# Altium project 采集卡第一版.PrjPCB (part 1 of 2)
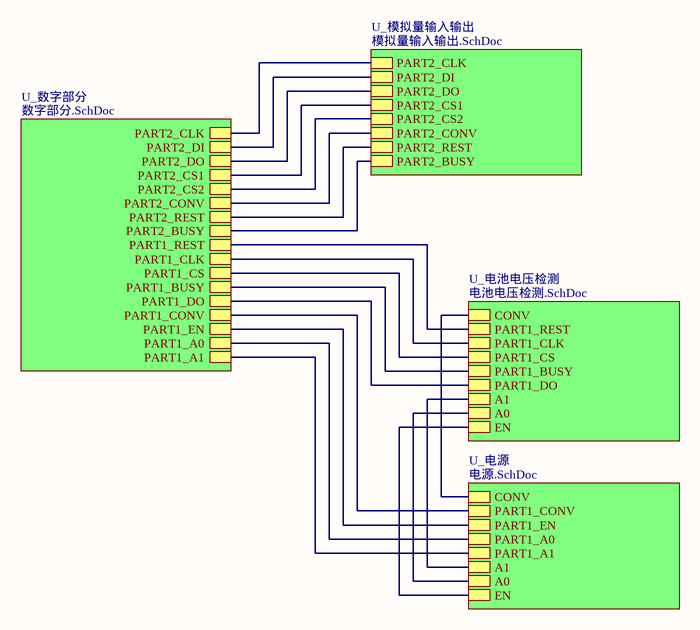
[diagram p0: 采集卡.SchDoc]
6 sheets, 612 parts. Net scope: hierarchical (ports join the sheet entries above them; power ports are global).
Board file: 采集卡.PcbDoc
Sheets:
  采集卡.SchDoc
    U_模拟量输入输出 = 模拟量输入输出.SchDoc
    U_电池电压检测 = 电池电压检测.SchDoc
      DI1 = AD628模块.SchDoc
      DI2 = AD628模块.SchDoc
      DI3 = AD628模块.SchDoc
      DI4 = AD628模块.SchDoc
      DI5 = AD628模块.SchDoc
      DI6 = AD628模块.SchDoc
      DI7 = AD628模块.SchDoc
      DI8 = AD628模块.SchDoc
    U_电源 = 电源.SchDoc
    U_数字部分 = 数字部分.SchDoc

## Sheet 采集卡.SchDoc
size A4

### Sub-sheets
U_数字部分 = 数字部分.SchDoc: PART1_REST, PART1_CLK, PART1_CS, PART1_BUSY, PART1_DO, PART1_CONV, PART1_EN, PART1_A0, PART1_A1, PART2_CLK, PART2_DI, PART2_DO, PART2_CS1, PART2_CS2, PART2_CONV, PART2_REST, PART2_BUSY
U_模拟量输入输出 = 模拟量输入输出.SchDoc: PART2_CLK, PART2_DI, PART2_DO, PART2_CS1, PART2_CS2, PART2_CONV, PART2_REST, PART2_BUSY
U_电池电压检测 = 电池电压检测.SchDoc: CONV, PART1_REST, PART1_CLK, PART1_CS, PART1_BUSY, PART1_DO, A1, A0, EN
U_电源 = 电源.SchDoc: CONV, PART1_CONV, PART1_EN, PART1_A0, PART1_A1, A1, A0, EN

### Nets
A0: sheet U_电池电压检测/A0, sheet U_电源/A0
A1: sheet U_电池电压检测/A1, sheet U_电源/A1
CONVA: sheet U_电池电压检测/CONV, sheet U_电源/CONV
DOUT1: sheet U_电池电压检测/PART1_REST, sheet U_数字部分/PART1_REST
DOUT2: sheet U_电源/PART1_EN, sheet U_数字部分/PART1_EN
DOUT3: sheet U_电源/PART1_A0, sheet U_数字部分/PART1_A0
DOUT4: sheet U_电源/PART1_A1, sheet U_数字部分/PART1_A1
DOUT5: sheet U_模拟量输入输出/PART2_REST, sheet U_数字部分/PART2_REST
EN: sheet U_电池电压检测/EN, sheet U_电源/EN
INT1: sheet U_电池电压检测/PART1_BUSY, sheet U_数字部分/PART1_BUSY
INT2: sheet U_模拟量输入输出/PART2_BUSY, sheet U_数字部分/PART2_BUSY
PWM1: sheet U_电源/PART1_CONV, sheet U_数字部分/PART1_CONV
PWM2: sheet U_模拟量输入输出/PART2_CONV, sheet U_数字部分/PART2_CONV
SPI1CS: sheet U_电池电压检测/PART1_CS, sheet U_数字部分/PART1_CS
SPI1DO: sheet U_电池电压检测/PART1_DO, sheet U_数字部分/PART1_DO
SPI1SCK: sheet U_电池电压检测/PART1_CLK, sheet U_数字部分/PART1_CLK
SPI2CS1: sheet U_模拟量输入输出/PART2_CS1, sheet U_数字部分/PART2_CS1
SPI2CS2: sheet U_模拟量输入输出/PART2_CS2, sheet U_数字部分/PART2_CS2
SPI2DI: sheet U_模拟量输入输出/PART2_DI, sheet U_数字部分/PART2_DI
SPI2DO: sheet U_模拟量输入输出/PART2_DO, sheet U_数字部分/PART2_DO
SPI2SCK: sheet U_模拟量输入输出/PART2_CLK, sheet U_数字部分/PART2_CLK

## Sheet 模拟量输入输出.SchDoc
size A1
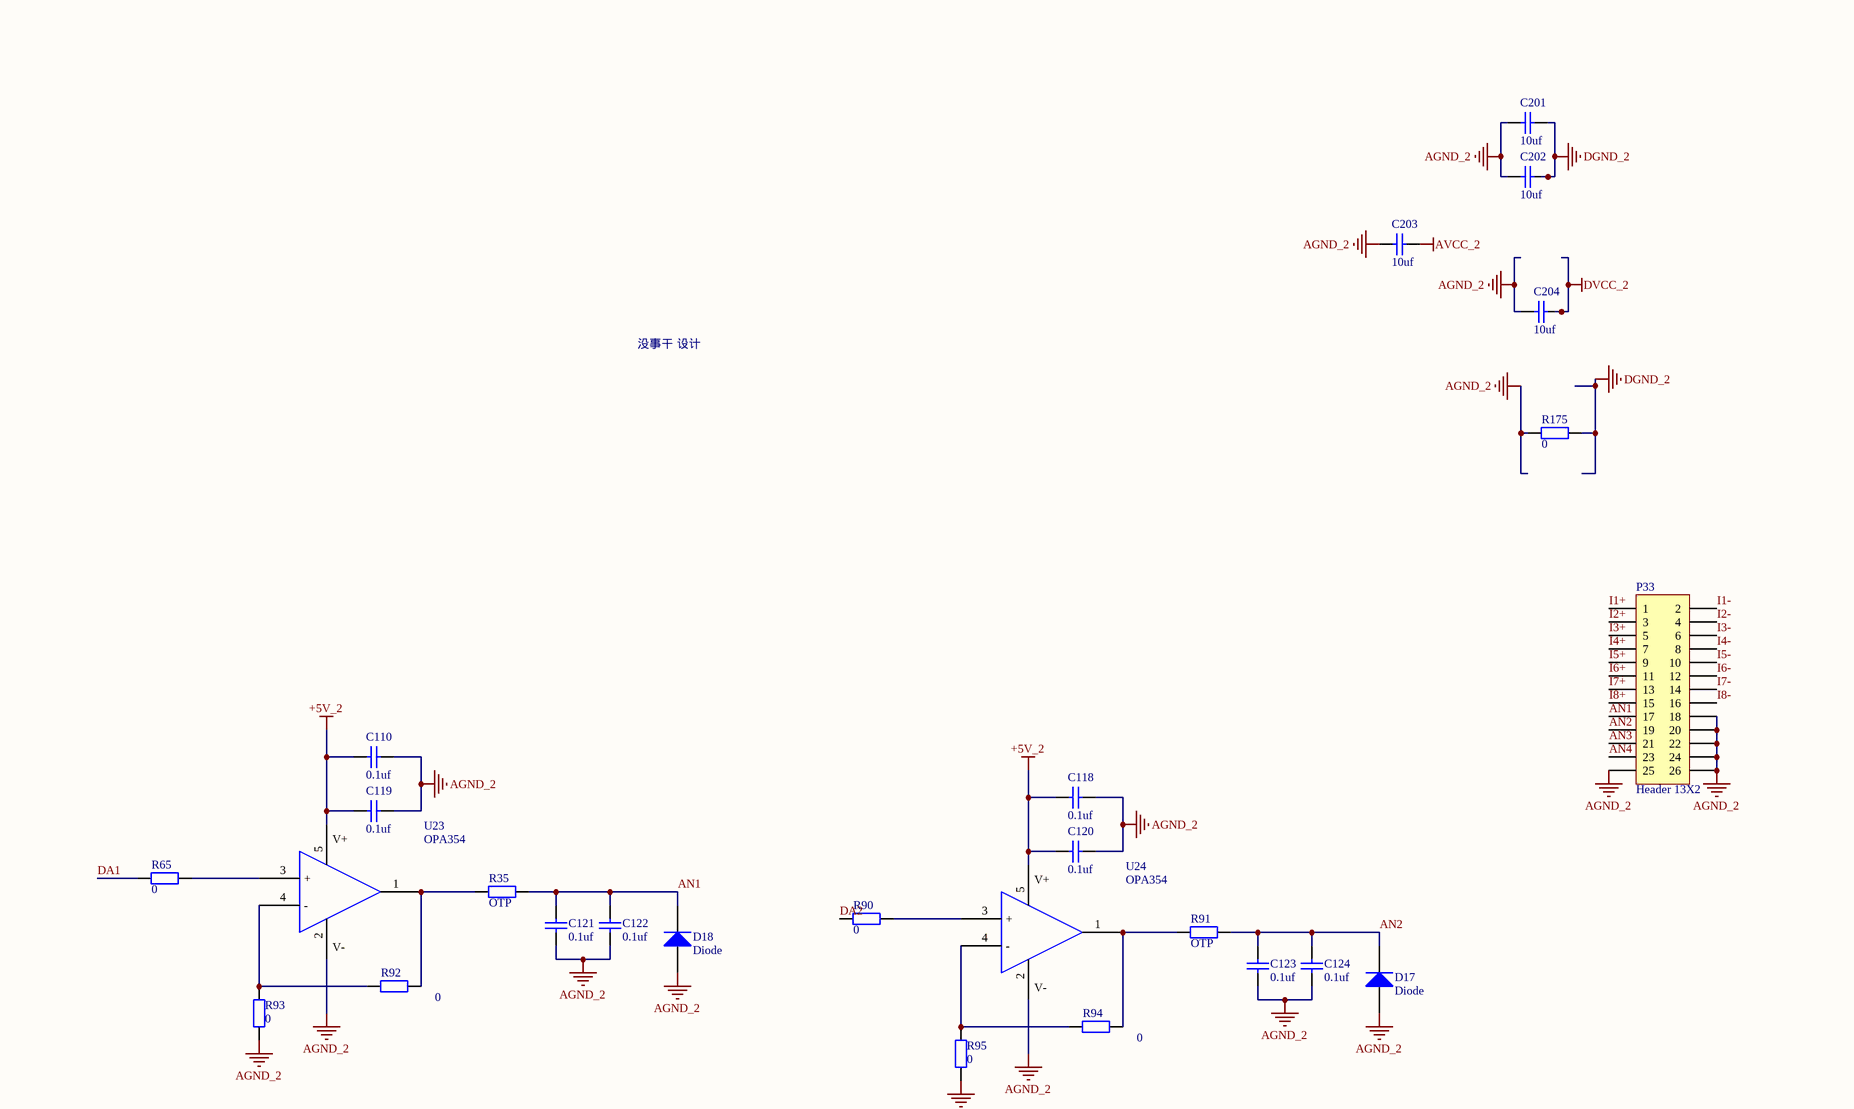
[diagram p1: 模拟量输入输出.SchDoc, top left]
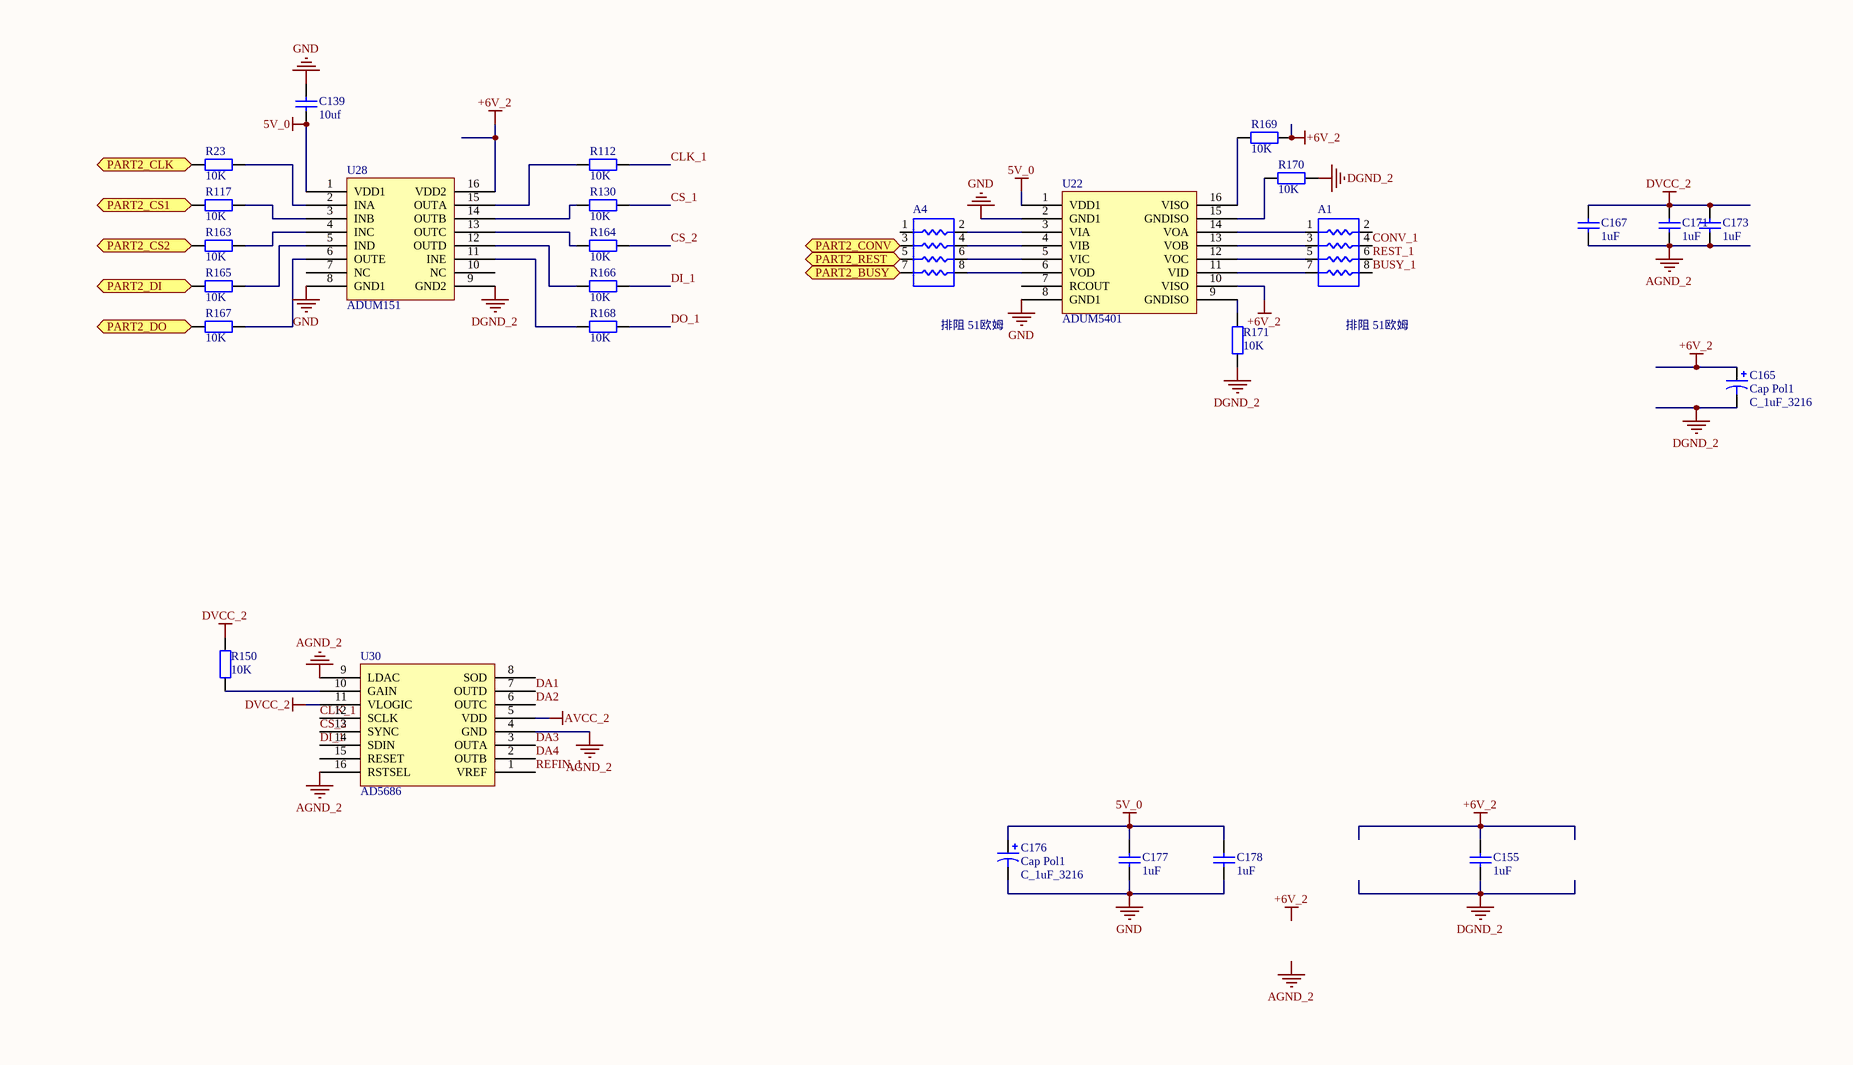
[diagram p2: 模拟量输入输出.SchDoc, top right]
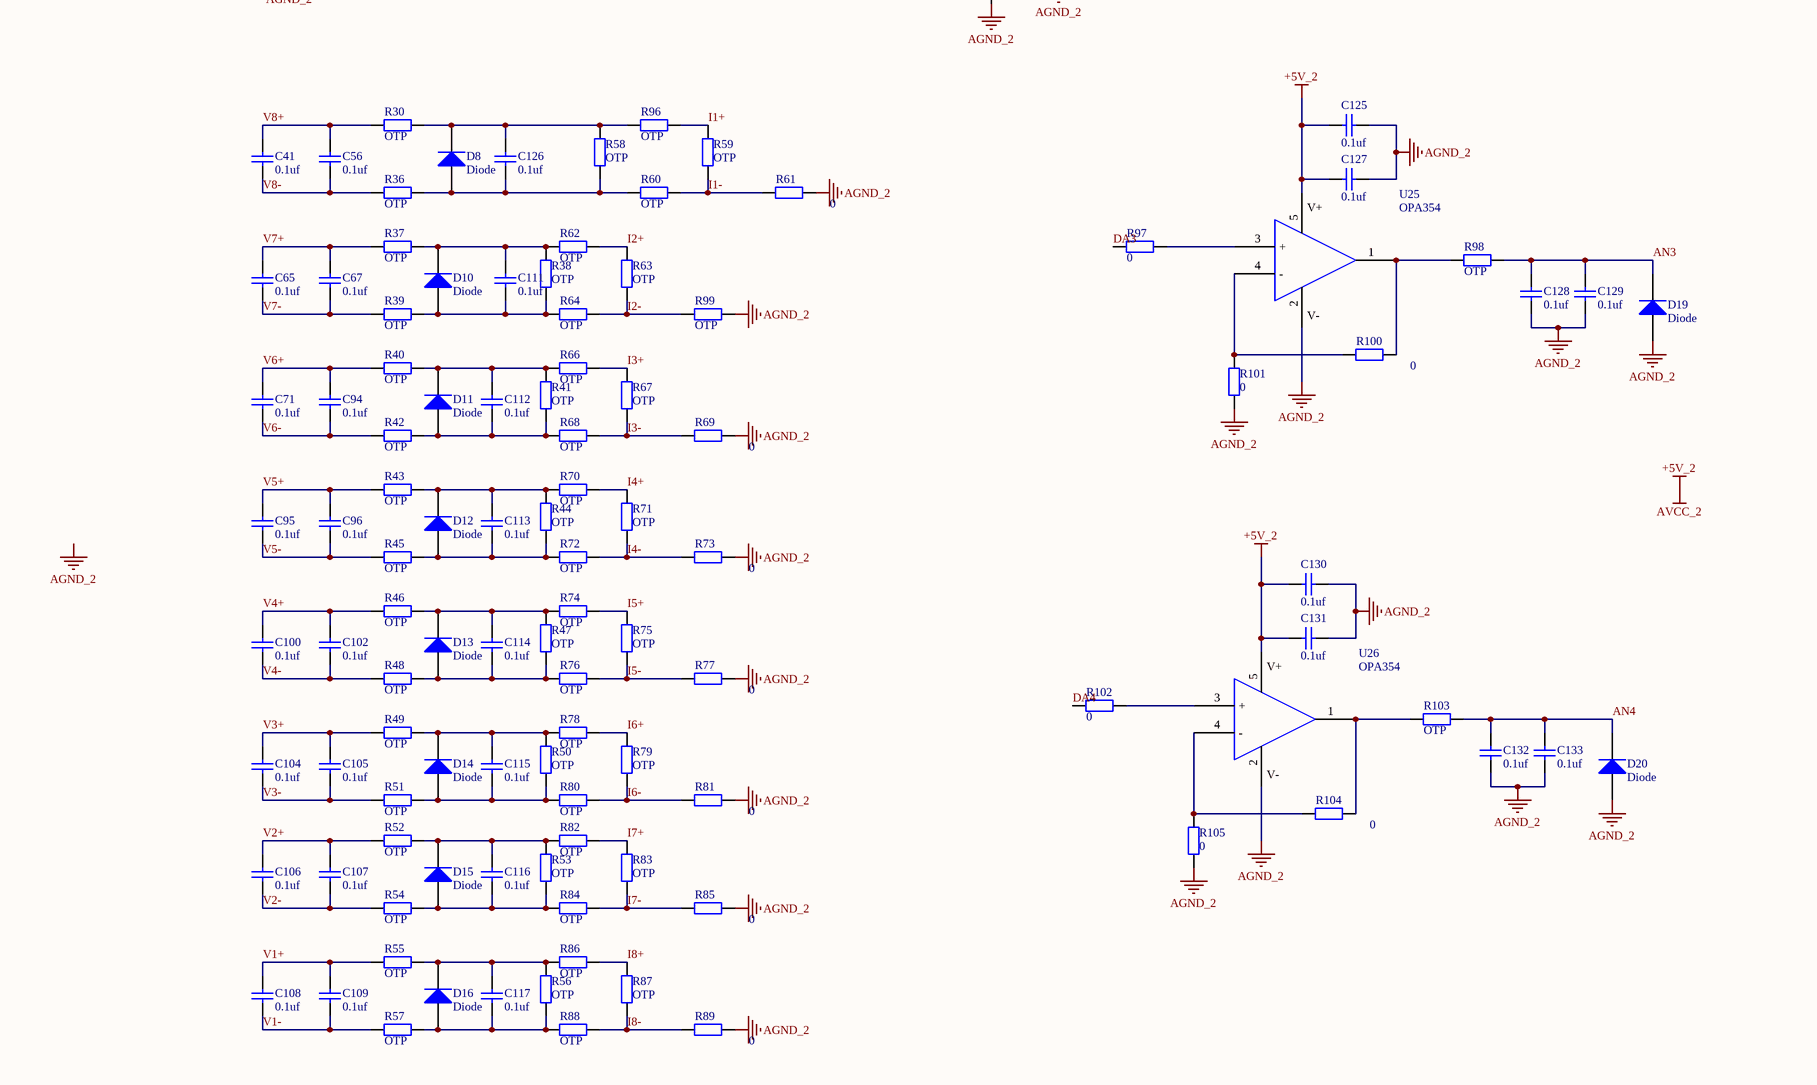
[diagram p3: 模拟量输入输出.SchDoc, bottom left]
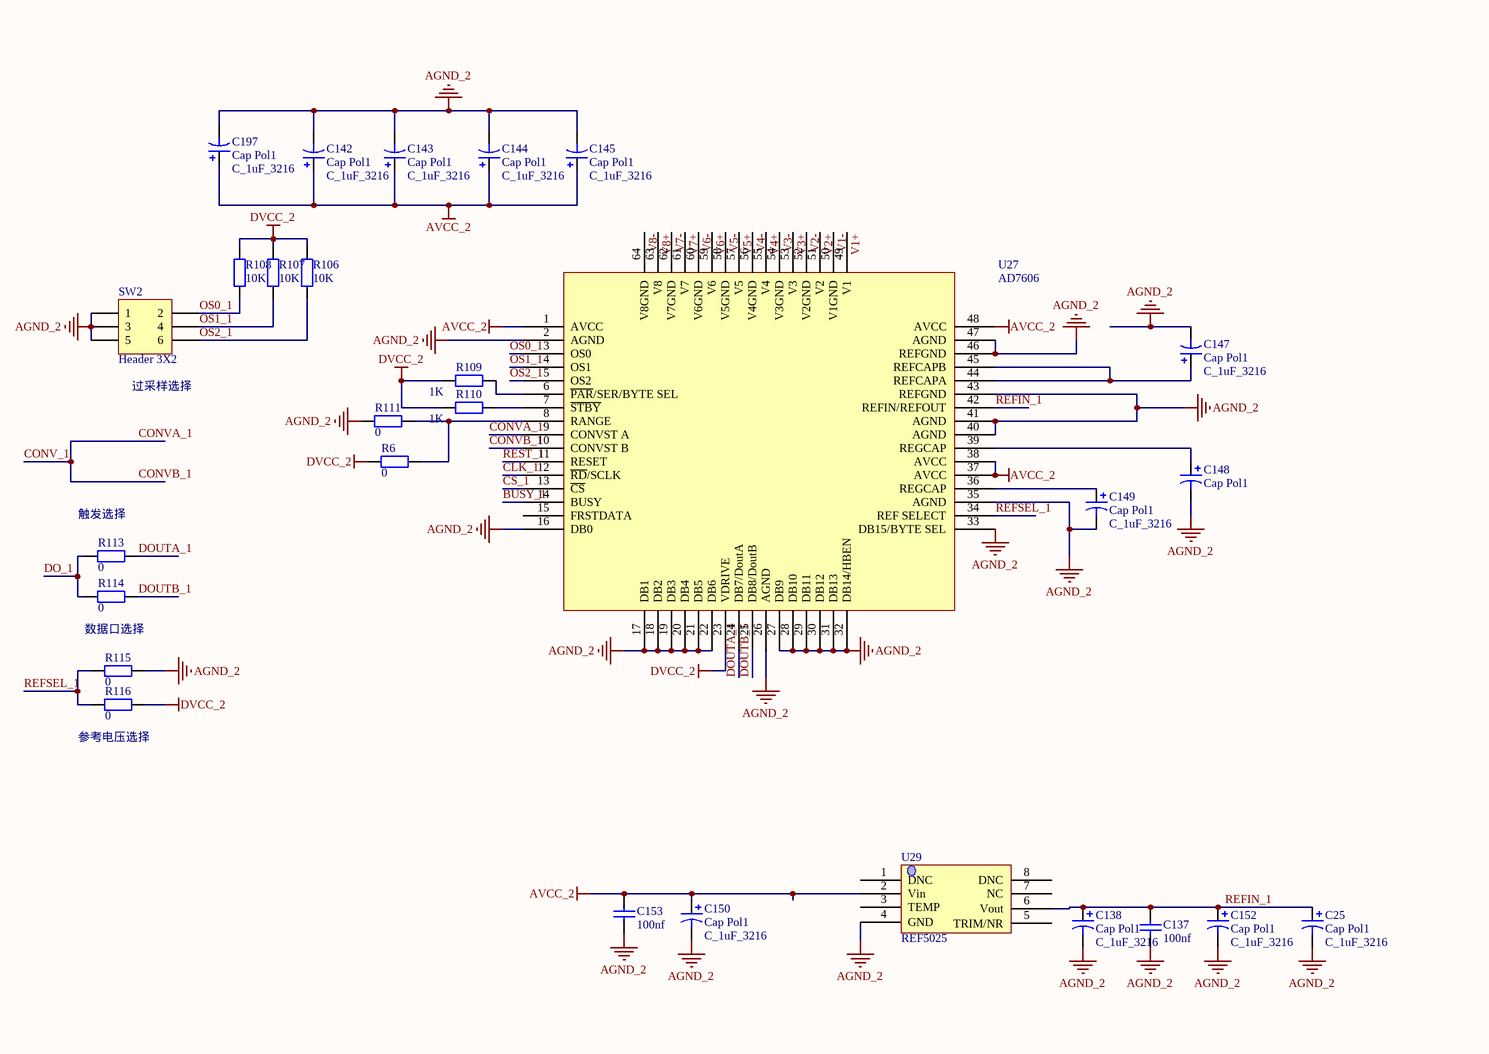
[diagram p4: 模拟量输入输出.SchDoc, bottom right]

### Parts
A1  排阻 51欧姆  [RCA03-4D]
A4  排阻 51欧姆  [RCA03-4D]
C25  Cap Pol1  value C_1uF_3216  [3216]
C41  value 0.1uf  [0805C]  (hidden comment: Cap)
C56  value 0.1uf  [0805C]  (hidden comment: Cap)
C65  value 0.1uf  [0805C]  (hidden comment: Cap)
C67  value 0.1uf  [0805C]  (hidden comment: Cap)
C71  value 0.1uf  [0805C]  (hidden comment: Cap)
C94  value 0.1uf  [0805C]  (hidden comment: Cap)
C95  value 0.1uf  [0805C]  (hidden comment: Cap)
C96  value 0.1uf  [0805C]  (hidden comment: Cap)
C100  value 0.1uf  [0805C]  (hidden comment: Cap)
C102  value 0.1uf  [0805C]  (hidden comment: Cap)
C104  value 0.1uf  [0805C]  (hidden comment: Cap)
C105  value 0.1uf  [0805C]  (hidden comment: Cap)
C106  value 0.1uf  [0805C]  (hidden comment: Cap)
C107  value 0.1uf  [0805C]  (hidden comment: Cap)
C108  value 0.1uf  [0805C]  (hidden comment: Cap)
C109  value 0.1uf  [0805C]  (hidden comment: Cap)
C110  value 0.1uf  [0805C]  (hidden comment: Cap)
C111  value 0.1uf  [0805C]  (hidden comment: Cap)
C112  value 0.1uf  [0805C]  (hidden comment: Cap)
C113  value 0.1uf  [0805C]  (hidden comment: Cap)
C114  value 0.1uf  [0805C]  (hidden comment: Cap)
C115  value 0.1uf  [0805C]  (hidden comment: Cap)
C116  value 0.1uf  [0805C]  (hidden comment: Cap)
C117  value 0.1uf  [0805C]  (hidden comment: Cap)
C118  value 0.1uf  [0805C]  (hidden comment: Cap)
C119  value 0.1uf  [0805C]  (hidden comment: Cap)
C120  value 0.1uf  [0805C]  (hidden comment: Cap)
C121  value 0.1uf  [0805C]  (hidden comment: Cap)
C122  value 0.1uf  [0805C]  (hidden comment: Cap)
C123  value 0.1uf  [0805C]  (hidden comment: Cap)
C124  value 0.1uf  [0805C]  (hidden comment: Cap)
C125  value 0.1uf  [0805C]  (hidden comment: Cap)
C126  value 0.1uf  [0805C]  (hidden comment: Cap)
C127  value 0.1uf  [0805C]  (hidden comment: Cap)
C128  value 0.1uf  [0805C]  (hidden comment: Cap)
C129  value 0.1uf  [0805C]  (hidden comment: Cap)
C130  value 0.1uf  [0805C]  (hidden comment: Cap)
C131  value 0.1uf  [0805C]  (hidden comment: Cap)
C132  value 0.1uf  [0805C]  (hidden comment: Cap)
C133  value 0.1uf  [0805C]  (hidden comment: Cap)
C137  value 100nf  [0805C]  (hidden comment: Cap)
C138  Cap Pol1  value C_1uF_3216  [3216]
C139  value 10uf  [0805C]  (hidden comment: Cap)
C142  Cap Pol1  value C_1uF_3216  [3216]
C143  Cap Pol1  value C_1uF_3216  [3216]
C144  Cap Pol1  value C_1uF_3216  [3216]
C145  Cap Pol1  value C_1uF_3216  [3216]
C147  Cap Pol1  value C_1uF_3216  [3216]
C148  Cap Pol1  [3216]
C149  Cap Pol1  value C_1uF_3216  [3216]
C150  Cap Pol1  value C_1uF_3216  [3216]
C152  Cap Pol1  value C_1uF_3216  [3216]
C153  value 100nf  [0805C]  (hidden comment: Cap)
C155  1uF  [0805C]
C165  Cap Pol1  value C_1uF_3216  [3216]
C167  1uF  [0805C]
C171  1uF  [0805C]
C173  1uF  [0805C]
C176  Cap Pol1  value C_1uF_3216  [3216]
C177  1uF  [0805C]
C178  1uF  [0805C]
C197  Cap Pol1  value C_1uF_3216  [3216]
C201  value 10uf  [0805C]  (hidden comment: Cap)
C202  value 10uf  [0805C]  (hidden comment: Cap)
C203  value 10uf  [0805C]  (hidden comment: Cap)
C204  value 10uf  [0805C]  (hidden comment: Cap)
D8  Diode  [SMA]
D10  Diode  [SMA]
D11  Diode  [SMA]
D12  Diode  [SMA]
D13  Diode  [SMA]
D14  Diode  [SMA]
D15  Diode  [SMA]
D16  Diode  [SMA]
D17  Diode  [SMA]
D18  Diode  [SMA]
D19  Diode  [SMA]
D20  Diode  [SMA]
P33  Header 13X2  [3.5MM-2*12P]
R6  value 0  [0805R]  (hidden comment: Res2)
R23  value 10K  [0805R]  (hidden comment: Res2)
R30  value OTP  [0805R]  (hidden comment: Res2)
R35  value OTP  [0805R]  (hidden comment: Res2)
R36  value OTP  [0805R]  (hidden comment: Res2)
R37  value OTP  [0805R]  (hidden comment: Res2)
R38  value OTP  [0805R]  (hidden comment: Res2)
R39  value OTP  [0805R]  (hidden comment: Res2)
R40  value OTP  [0805R]  (hidden comment: Res2)
R41  value OTP  [0805R]  (hidden comment: Res2)
R42  value OTP  [0805R]  (hidden comment: Res2)
R43  value OTP  [0805R]  (hidden comment: Res2)
R44  value OTP  [0805R]  (hidden comment: Res2)
R45  value OTP  [0805R]  (hidden comment: Res2)
R46  value OTP  [0805R]  (hidden comment: Res2)
R47  value OTP  [0805R]  (hidden comment: Res2)
R48  value OTP  [0805R]  (hidden comment: Res2)
R49  value OTP  [0805R]  (hidden comment: Res2)
R50  value OTP  [0805R]  (hidden comment: Res2)
R51  value OTP  [0805R]  (hidden comment: Res2)
R52  value OTP  [0805R]  (hidden comment: Res2)
R53  value OTP  [0805R]  (hidden comment: Res2)
R54  value OTP  [0805R]  (hidden comment: Res2)
R55  value OTP  [0805R]  (hidden comment: Res2)
R56  value OTP  [0805R]  (hidden comment: Res2)
R57  value OTP  [0805R]  (hidden comment: Res2)
R58  value OTP  [0805R]  (hidden comment: Res2)
R59  value OTP  [FB1206]  (hidden comment: Res2)
R60  value OTP  [0805R]  (hidden comment: Res2)
R61  value 0  [0603AR]  (hidden comment: Res2)
R62  value OTP  [0805R]  (hidden comment: Res2)
R63  value OTP  [FB1206]  (hidden comment: Res2)
R64  value OTP  [0805R]  (hidden comment: Res2)
R65  value 0  [0805R]  (hidden comment: Res2)
R66  value OTP  [0805R]  (hidden comment: Res2)
R67  value OTP  [FB1206]  (hidden comment: Res2)
R68  value OTP  [0805R]  (hidden comment: Res2)
R69  value 0  [0603AR]  (hidden comment: Res2)
R70  value OTP  [0805R]  (hidden comment: Res2)
R71  value OTP  [FB1206]  (hidden comment: Res2)
R72  value OTP  [0805R]  (hidden comment: Res2)
R73  value 0  [0603AR]  (hidden comment: Res2)
R74  value OTP  [0805R]  (hidden comment: Res2)
R75  value OTP  [FB1206]  (hidden comment: Res2)
R76  value OTP  [0805R]  (hidden comment: Res2)
R77  value 0  [0603AR]  (hidden comment: Res2)
R78  value OTP  [0805R]  (hidden comment: Res2)
R79  value OTP  [FB1206]  (hidden comment: Res2)
R80  value OTP  [0805R]  (hidden comment: Res2)
R81  value 0  [0603AR]  (hidden comment: Res2)
R82  value OTP  [0805R]  (hidden comment: Res2)
R83  value OTP  [FB1206]  (hidden comment: Res2)
R84  value OTP  [0805R]  (hidden comment: Res2)
R85  value 0  [0603AR]  (hidden comment: Res2)
R86  value OTP  [0805R]  (hidden comment: Res2)
R87  value OTP  [FB1206]  (hidden comment: Res2)
R88  value OTP  [0805R]  (hidden comment: Res2)
R89  value 0  [0603AR]  (hidden comment: Res2)
R90  value 0  [0805R]  (hidden comment: Res2)
R91  value OTP  [0805R]  (hidden comment: Res2)
R92  value 0  [0805R]  (hidden comment: Res2)
R93  value 0  [0805R]  (hidden comment: Res2)
R94  value 0  [0805R]  (hidden comment: Res2)
R95  value 0  [0805R]  (hidden comment: Res2)
R96  value OTP  [0805R]  (hidden comment: Res2)
R97  value 0  [0805R]  (hidden comment: Res2)
R98  value OTP  [0805R]  (hidden comment: Res2)
R99  value OTP  [0603AR]  (hidden comment: Res2)
R100  value 0  [0805R]  (hidden comment: Res2)
R101  value 0  [0805R]  (hidden comment: Res2)
R102  value 0  [0805R]  (hidden comment: Res2)
R103  value OTP  [0805R]  (hidden comment: Res2)
R104  value 0  [0805R]  (hidden comment: Res2)
R105  value 0  [0805R]  (hidden comment: Res2)
R106  value 10K  [0805R]  (hidden comment: Res2)
R107  value 10K  [0805R]  (hidden comment: Res2)
R108  value 10K  [0805R]  (hidden comment: Res2)
R109  value 1K  [0805R]  (hidden comment: Res2)
R110  value 1K  [0805R]  (hidden comment: Res2)
R111  value 0  [0805R]  (hidden comment: Res2)
R112  value 10K  [0805R]  (hidden comment: Res2)
R113  value 0  [0805R]  (hidden comment: Res2)
R114  value 0  [0805R]  (hidden comment: Res2)
R115  value 0  [0805R]  (hidden comment: Res2)
R116  value 0  [0805R]  (hidden comment: Res2)
R117  value 10K  [0805R]  (hidden comment: Res2)
R130  value 10K  [0805R]  (hidden comment: Res2)
R150  value 10K  [0805R]  (hidden comment: Res2)
R163  value 10K  [0805R]  (hidden comment: Res2)
R164  value 10K  [0805R]  (hidden comment: Res2)
R165  value 10K  [0805R]  (hidden comment: Res2)
R166  value 10K  [0805R]  (hidden comment: Res2)
R167  value 10K  [0805R]  (hidden comment: Res2)
R168  value 10K  [0805R]  (hidden comment: Res2)
R169  value 10K  [0603AR]  (hidden comment: Res2)
R170  value 10K  [0603AR]  (hidden comment: Res2)
R171  value 10K  [0603AR]  (hidden comment: Res2)
R175  value 0  [0805R]  (hidden comment: Res2)
SW2  Header 3X2  [SW_6]
U22  ADUM5401  [SOL-16_L]
U23  OPA354  [SOT23-5]
U24  OPA354  [SOT23-5]
U25  OPA354  [SOT23-5]
U26  OPA354  [SOT23-5]
U27  AD7606  [TQFP64]
U28  ADUM151  [SO16NB]
U29  REF5025  [MSOP8]
U30  AD5686  [TSSOP16]

### Ports
PART2_BUSY, PART2_CLK, PART2_CONV, PART2_CS1, PART2_CS2, PART2_DI, PART2_DO, PART2_REST

### Nets
5V_0: C139.2 C176.1 C177.1 C178.1 U22.1(VDD1) U28.1(VDD1)
+5V_2: C110.2 C118.2 C119.2 C120.2 C125.2 C127.2 C130.2 C131.2 C142.1 C143.1 C144.1 C145.1 C150.1 C153.2 C197.1 C203.1 U23.5(V+) U24.5(V+) U25.5(V+) U26.5(V+) U27.1(AVCC) U27.37(AVCC) U27.38(AVCC) U27.48(AVCC) U29.2(Vin) U30.5(VDD)  [also labelled AVCC_2]
+6V_2: C155.1 C165.1 R169.1 U22.10(VISO) U28.16(VDD2)
AGND_2: C25.2 C110.1 C118.1 C119.1 C120.1 C121.1 C122.1 C123.1 C124.1 C125.1 C127.1 C128.1 C129.1 C130.1 C131.1 C132.1 C133.1 C137.1 C138.2 C142.2 C143.2 C144.2 C145.2 C147.2 C148.2 C149.2 C150.2 C152.2 C153.1 C167.2 C171.2 C173.2 C197.2 C201.2 C202.2 C203.2 C204.2 D17.1(A) D18.1(A) D19.1(A) D20.1(A) P33.18 P33.20 P33.22 P33.24 P33.25 P33.26 R61.1 R69.1 R73.1 R77.1 R81.1 R85.1 R89.1 R93.2 R95.2 R99.1 R101.2 R105.2 R111.2 R115.1 R175.2 SW2.1 SW2.3 SW2.5 U23.2(V-) U24.2(V-) U25.2(V-) U26.2(V-) U27.2(AGND) U27.16(DB0) U27.17(DB1) U27.18(DB2) U27.19(DB3) U27.20(DB4) U27.21(DB5) U27.22(DB6) U27.26(AGND) U27.27(DB9) U27.28(DB10) U27.29(DB11) U27.30(DB12) U27.31(DB13) U27.32(DB14/HBEN) U27.33(DB15/BYTE_SEL) U27.35(AGND) U27.40(AGND) U27.41(AGND) U27.43(REFGND) U27.46(REFGND) U27.47(AGND) U29.4(GND) U30.4(GND) U30.9(LDAC) U30.16(RSTSEL)
DGND_2: C155.2 C165.2 C201.1 C202.1 R170.1 R171.2 R175.1 U28.9(GND2)
DVCC_2: C167.1 C171.1 C173.1 C204.1 R6.2 R106.1 R107.1 R108.1 R109.2 R110.2 R116.1 R150.1 U27.23(VDRIVE) U30.11(VLOGIC)
GND: C139.1 C176.2 C177.2 C178.2 U22.2(GND1) U22.8(GND1) U28.8(GND1)
AN1: C121.2 C122.2 D18.2(K) P33.17 R35.2
AN2: C123.2 C124.2 D17.2(K) P33.19 R91.2
AN3: C128.2 C129.2 D19.2(K) P33.21 R98.2
AN4: C132.2 C133.2 D20.2(K) P33.23 R103.2
BUSY_1: A1.8 U27.14(BUSY)
CLK_1: R112.1 U27.12(~{RD}/SCLK) U30.12(SCLK)
CONV_1: A1.4 U27.9(CONVST_A) U27.10(CONVST_B)  [also labelled CONVA_1, CONVB_1]
CS_1: R130.1 U27.13(~{CS})
CS_2: R164.1 U30.13(SYNC)
DA1: R65.1 U30.7(OUTD)
DA2: R90.1 U30.6(OUTC)
DA3: R97.1 U30.3(OUTA)
DA4: R102.1 U30.2(OUTB)
DI_1: R166.1 U30.14(SDIN)
DO_1: R113.1 R114.1 R168.1
DOUT5: A4.5 ; port PART2_REST
DOUTA_1: R113.2 U27.24(DB7/DoutA)
DOUTB_1: R114.2 U27.25(DB8/DoutB)
I1+: P33.1 R59.2 R96.2
I1-: P33.2 R59.1 R60.2 R61.2
I2+: P33.3 R62.2 R63.1
I2-: P33.4 R63.2 R64.2 R99.2
I3+: P33.5 R66.2 R67.1
I3-: P33.6 R67.2 R68.2 R69.2
I4+: P33.7 R70.2 R71.1
I4-: P33.8 R71.2 R72.2 R73.2
I5+: P33.9 R74.2 R75.1
I5-: P33.10 R75.2 R76.2 R77.2
I6+: P33.11 R78.2 R79.1
I6-: P33.12 R79.2 R80.2 R81.2
I7+: P33.13 R82.2 R83.1
I7-: P33.14 R83.2 R84.2 R85.2
I8+: P33.15 R86.2 R87.1
I8-: P33.16 R87.2 R88.2 R89.2
INT2: A4.7 ; port PART2_BUSY
OS0_1: R108.2 SW2.2 U27.3(OS0)
OS1_1: R107.2 SW2.4 U27.4(OS1)
OS2_1: R106.2 SW2.6 U27.5(OS2)
PWM2: A4.3 ; port PART2_CONV
REFIN_1: C25.1 C137.2 C138.1 C152.1 U27.42(REFIN/REFOUT) U29.6(Vout) U30.1(VREF)
REFSEL_1: R115.2 R116.2 U27.34(REF_SELECT)
REST_1: A1.6 U27.11(RESET)
SPI2CS1: R117.2 ; port PART2_CS1
SPI2CS2: R163.2 ; port PART2_CS2
SPI2DI: R165.2 ; port PART2_DI
SPI2DO: R167.2 ; port PART2_DO
SPI2SCK: R23.2 ; port PART2_CLK
V1+: C108.2 C109.2 R55.2 U27.49(V1)
V1-: C108.1 C109.1 R57.2 U27.50(V1GND)
V2+: C106.2 C107.2 R52.2 U27.51(V2)
V2-: C106.1 C107.1 R54.2 U27.52(V2GND)
V3+: C104.2 C105.2 R49.2 U27.53(V3)
V3-: C104.1 C105.1 R51.2 U27.54(V3GND)
V4+: C100.2 C102.2 R46.2 U27.55(V4)
V4-: C100.1 C102.1 R48.2 U27.56(V4GND)
V5+: C95.2 C96.2 R43.2 U27.57(V5)
V5-: C95.1 C96.1 R45.2 U27.58(V5GND)
V6+: C71.2 C94.2 R40.2 U27.59(V6)
V6-: C71.1 C94.1 R42.2 U27.60(V6GND)
V7+: C65.2 C67.2 R37.2 U27.61(V7)
V7-: C65.1 C67.1 R39.2 U27.62(V7GND)
V8+: C41.2 C56.2 R30.2 U27.63(V8)
V8-: C41.1 C56.1 R36.2 U27.64(V8GND)
NetA1_1: A1.1 U22.14(VOA)
NetA1_3: A1.3 U22.13(VOB)
NetA1_5: A1.5 U22.12(VOC)
NetA1_7: A1.7 U22.11(VID)
NetA4_2: A4.2 U22.3(VIA)
NetA4_4: A4.4 U22.4(VIB)
NetA4_6: A4.6 U22.5(VIC)
NetA4_8: A4.8 U22.6(VOD)
NetC111_1: C111.1 D10.1(A) R38.2 R39.1 R64.1
NetC111_2: C111.2 D10.2(K) R37.1 R38.1 R62.1
NetC112_1: C112.1 D11.1(A) R41.2 R42.1 R68.1
NetC112_2: C112.2 D11.2(K) R40.1 R41.1 R66.1
NetC113_1: C113.1 D12.1(A) R44.2 R45.1 R72.1
NetC113_2: C113.2 D12.2(K) R43.1 R44.1 R70.1
NetC114_1: C114.1 D13.1(A) R47.2 R48.1 R76.1
NetC114_2: C114.2 D13.2(K) R46.1 R47.1 R74.1
NetC115_1: C115.1 D14.1(A) R50.2 R51.1 R80.1
NetC115_2: C115.2 D14.2(K) R49.1 R50.1 R78.1
NetC116_1: C116.1 D15.1(A) R53.2 R54.1 R84.1
NetC116_2: C116.2 D15.2(K) R52.1 R53.1 R82.1
NetC117_1: C117.1 D16.1(A) R56.2 R57.1 R88.1
NetC117_2: C117.2 D16.2(K) R55.1 R56.1 R86.1
NetC126_1: C126.1 D8.1(A) R36.1 R58.1 R60.1
NetC126_2: C126.2 D8.2(K) R30.1 R58.2 R96.1
NetC147_1: C147.1 U27.44(REFCAPA) U27.45(REFCAPB)
NetC148_1: C148.1 U27.39(REGCAP)
NetC149_1: C149.1 U27.36(REGCAP)
NetR6_1: R6.1 R111.1 U27.8(RANGE)
NetR23_1: R23.1 U28.2(INA)
NetR35_1: R35.1 R92.1 U23.1(OUT)
NetR65_2: R65.2 U23.3(+)
NetR90_2: R90.2 U24.3(+)
NetR91_1: R91.1 R94.1 U24.1(OUT)
NetR92_2: R92.2 R93.1 U23.4(-)
NetR94_2: R94.2 R95.1 U24.4(-)
NetR97_2: R97.2 U25.3(+)
NetR98_1: R98.1 R100.1 U25.1(OUT)
NetR100_2: R100.2 R101.1 U25.4(-)
NetR102_2: R102.2 U26.3(+)
NetR103_1: R103.1 R104.1 U26.1(OUT)
NetR104_2: R104.2 R105.1 U26.4(-)
NetR109_1: R109.1 U27.6(~{PAR}/SER/BYTE_SEL)
NetR110_1: R110.1 U27.7(~{STBY})
NetR112_2: R112.2 U28.15(OUTA)
NetR117_1: R117.1 U28.3(INB)
NetR130_2: R130.2 U28.14(OUTB)
NetR150_2: R150.2 U30.10(GAIN)
NetR163_1: R163.1 U28.4(INC)
NetR164_2: R164.2 U28.13(OUTC)
NetR165_1: R165.1 U28.5(IND)
NetR166_2: R166.2 U28.12(OUTD)
NetR167_1: R167.1 U28.6(OUTE)
NetR168_2: R168.2 U28.11(INE)
NetR169_2: R169.2 U22.16(VISO)
NetR170_2: R170.2 U22.15(GNDISO)
NetR171_1: R171.1 U22.9(GNDISO)

Not connected (* = marked no-connect by the designer): A1 2; A4 1; U22 7(RCOUT); U27 15(FRSTDATA); U28 7(NC) 10(NC); U29 1(DNC) 3(TEMP) 5(TRIM/NR) 7(NC) 8(DNC); U30 8(SOD) 15(RESET)

### Notes on the sheet
- 没事干 设计
- (near SW2) 过采样选择
- (near R113) 触发选择
- 数据口选择
- (near R116) 参考电压选择
- Labels drawn without touching a wire or pin: +6V_2, AGND_2

### Library data of the parts
A1 A4 = RESPACK5
C25 C138 C142-C145 C147-C150 C152 C165 C176 C197 = Cap Pol1: Polarized Capacitor (Radial); Published: 8-Jun-2000; LatestRevisionDate: 17-Jul-2002; LatestRevisionNote: Re-released for DXP Platform.; PackageReference: RB7.6-15; Publisher: Altium Limited
C41 C56 C65 C67 C71 C94-C96 C100 C102 C104-C133 C137 C139 C153 C155 C167 C171 C173 C177 C178 C201-C204 = Cap: Capacitor; Published: 8-Jun-2000; LatestRevisionDate: 17-Jul-2002; LatestRevisionNote: Re-released for DXP Platform.; PackageReference: RAD-0.3; Publisher: Altium Limited; PackageDescription: Radial Cap, Thru-Hole; 2 Leads; 0.3 in Pin Spacing
  C155 C167 C171 C173 C177 C178: Value: 1uF
D8 D10-D20 = Diode: Default Diode; Published: 8-Jun-2000; LatestRevisionDate: 17-Jul-2002; LatestRevisionNote: Re-released for DXP Platform.; PackageVersion: Sep-1996; PackageReference: SMC; Publisher: Altium Limited; PackageDescription: DO-214-AB/SMC; 2 C-Bend Leads; Body 7.9 x 5.9 mm, inc. leads (LxW); Code_JEDEC: DO-214-AB
P33 = Header 13X2: Header, 13-Pin, Dual row; LatestRevisionDate: 17-Jul-2002; LatestRevisionNote: Re-released for DXP Platform.; Publisher: Altium Limited
R6 R23 R30 R35-R117 R130 R150 R163-R171 R175 = Res2: Resistor; Published: 8-Jun-2000; LatestRevisionDate: 17-Jul-2002; LatestRevisionNote: Re-released for DXP Platform.; PackageReference: AXIAL-0.4; Publisher: Altium Limited; PackageDescription: Axial Device, Thru-Hole; 2 Leads; 0.4 in Pin Spacing
SW2 = Header 3X2: Header, 3-Pin, Dual row; LatestRevisionDate: 17-Jul-2002; LatestRevisionNote: Re-released for DXP Platform.; Publisher: Altium Limited
U23-U26 = OPA354: 250MHz, Rail-to-Rail I/O, CMOS

## Sheet 电池电压检测.SchDoc
size A2
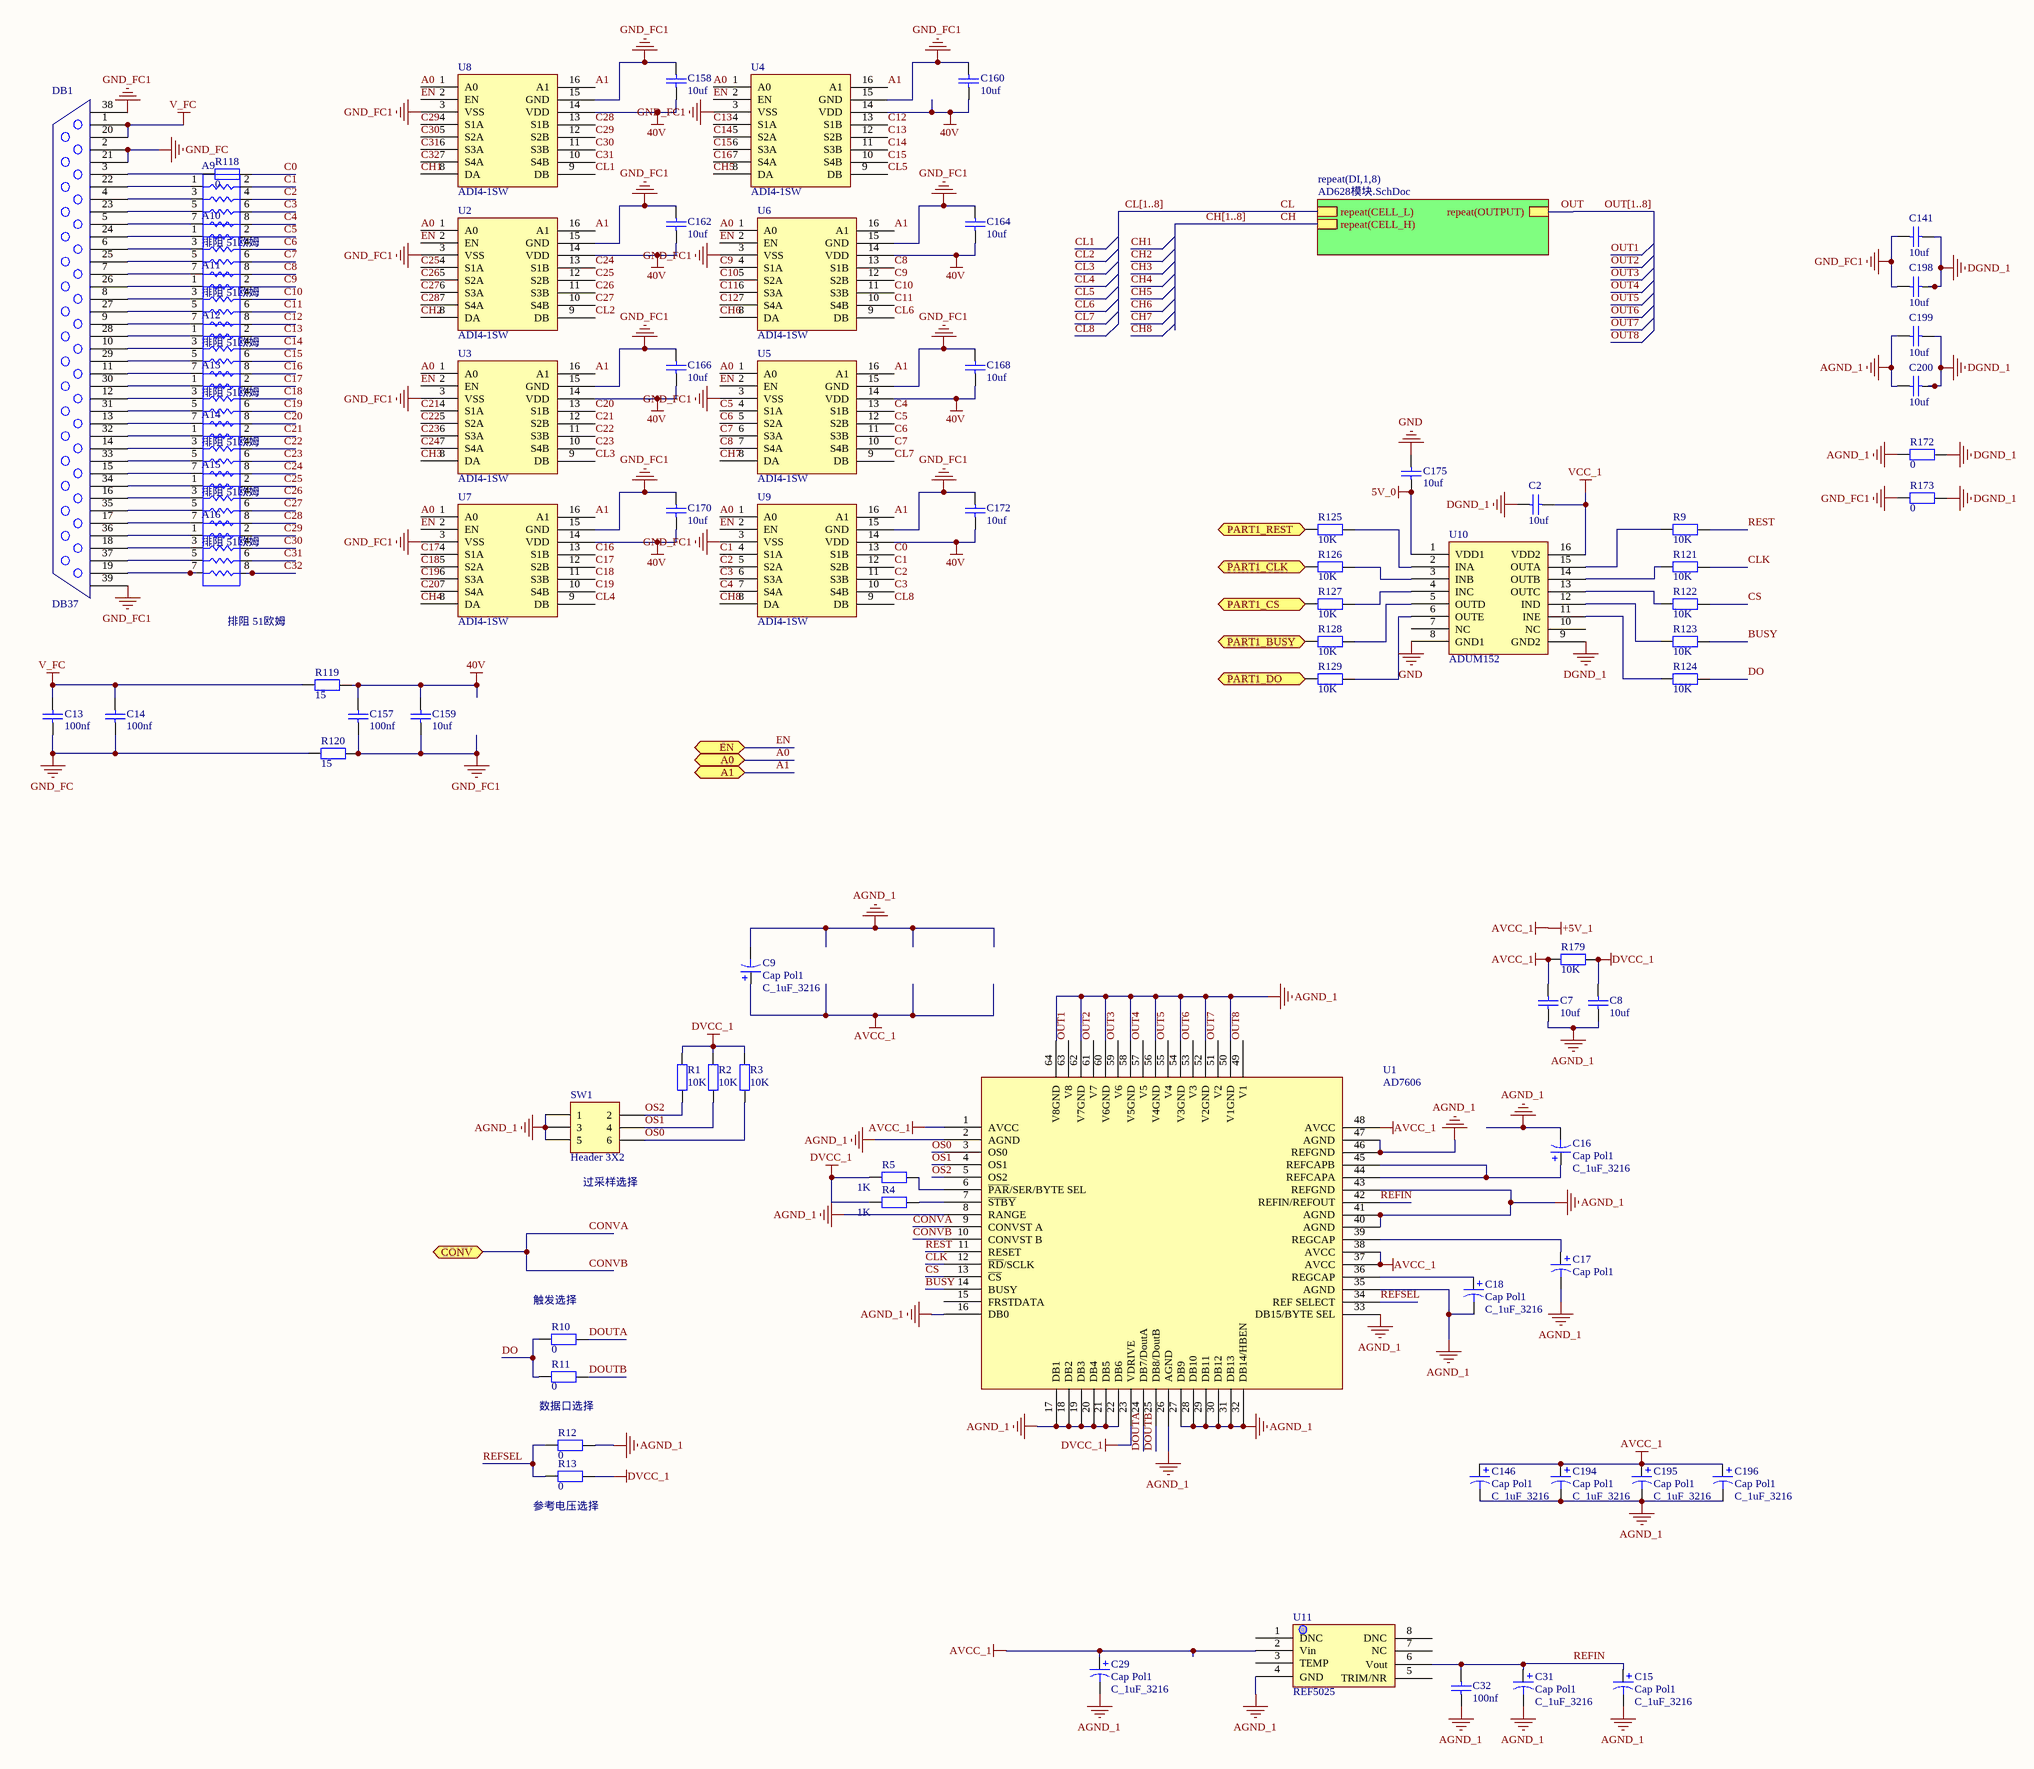
[diagram p5: 电池电压检测.SchDoc]

### Parts
A9  排阻 51欧姆  [RCA03-4D]
A10  排阻 51欧姆  [RCA03-4D]
A11  排阻 51欧姆  [RCA03-4D]
A12  排阻 51欧姆  [RCA03-4D]
A13  排阻 51欧姆  [RCA03-4D]
A14  排阻 51欧姆  [RCA03-4D]
A15  排阻 51欧姆  [RCA03-4D]
A16  排阻 51欧姆  [RCA03-4D]
C2  value 10uf  [0805C]  (hidden comment: Cap)
C7  value 10uf  [0805C]  (hidden comment: Cap)
C8  value 10uf  [0805C]  (hidden comment: Cap)
C9  Cap Pol1  value C_1uF_3216  [3216]
C13  value 100nf  [1812-C]  (hidden comment: Cap)
C14  value 100nf  [1812-C]  (hidden comment: Cap)
C15  Cap Pol1  value C_1uF_3216  [3216]
C16  Cap Pol1  value C_1uF_3216  [3216]
C17  Cap Pol1  [3216]
C18  Cap Pol1  value C_1uF_3216  [3216]
C29  Cap Pol1  value C_1uF_3216  [3216]
C31  Cap Pol1  value C_1uF_3216  [3216]
C32  value 100nf  [0805C]  (hidden comment: Cap)
C141  value 10uf  [0805C]  (hidden comment: Cap)
C146  Cap Pol1  value C_1uF_3216  [3216]
C157  value 100nf  [1812-C]  (hidden comment: Cap)
C158  value 10uf  [0805C]  (hidden comment: Cap)
C159  value 10uf  [0805C]  (hidden comment: Cap)
C160  value 10uf  [0805C]  (hidden comment: Cap)
C162  value 10uf  [0805C]  (hidden comment: Cap)
C164  value 10uf  [0805C]  (hidden comment: Cap)
C166  value 10uf  [0805C]  (hidden comment: Cap)
C168  value 10uf  [0805C]  (hidden comment: Cap)
C170  value 10uf  [0805C]  (hidden comment: Cap)
C172  value 10uf  [0805C]  (hidden comment: Cap)
C175  value 10uf  [0805C]  (hidden comment: Cap)
C194  Cap Pol1  value C_1uF_3216  [3216]
C195  Cap Pol1  value C_1uF_3216  [3216]
C196  Cap Pol1  value C_1uF_3216  [3216]
C198  value 10uf  [0805C]  (hidden comment: Cap)
C199  value 10uf  [0805C]  (hidden comment: Cap)
C200  value 10uf  [0805C]  (hidden comment: Cap)
DB1  DB37  [DB37]
R1  value 10K  [0805R]  (hidden comment: Res2)
R2  value 10K  [0805R]  (hidden comment: Res2)
R3  value 10K  [0805R]  (hidden comment: Res2)
R4  value 1K  [0805R]  (hidden comment: Res2)
R5  value 1K  [0805R]  (hidden comment: Res2)
R9  value 10K  [0805R]  (hidden comment: Res2)
R10  value 0  [0805R]  (hidden comment: Res2)
R11  value 0  [0805R]  (hidden comment: Res2)
R12  value 0  [0805R]  (hidden comment: Res2)
R13  value 0  [0805R]  (hidden comment: Res2)
R118  value 0  [0603AR]  (hidden comment: Res2)
R119  value 15  [0805R]  (hidden comment: Res2)
R120  value 15  [0805R]  (hidden comment: Res2)
R121  value 10K  [0805R]  (hidden comment: Res2)
R122  value 10K  [0805R]  (hidden comment: Res2)
R123  value 10K  [0805R]  (hidden comment: Res2)
R124  value 10K  [0805R]  (hidden comment: Res2)
R125  value 10K  [0805R]  (hidden comment: Res2)
R126  value 10K  [0805R]  (hidden comment: Res2)
R127  value 10K  [0805R]  (hidden comment: Res2)
R128  value 10K  [0805R]  (hidden comment: Res2)
R129  value 10K  [0805R]  (hidden comment: Res2)
R172  value 0  [0805R]  (hidden comment: Res2)
R173  value 0  [0805R]  (hidden comment: Res2)
R179  value 10K  [0805R]  (hidden comment: Res2)
SW1  Header 3X2  [SW_6]
U1  AD7606  [TQFP64]
U2  ADI4-1SW  [TSSOP16]
U3  ADI4-1SW  [TSSOP16]
U4  ADI4-1SW  [TSSOP16]
U5  ADI4-1SW  [TSSOP16]
U6  ADI4-1SW  [TSSOP16]
U7  ADI4-1SW  [TSSOP16]
U8  ADI4-1SW  [TSSOP16]
U9  ADI4-1SW  [TSSOP16]
U10  ADUM152  [SO16NB]
U11  REF5025  [SOP8]

### Sub-sheets
repeat(DI,1,8) = AD628模块.SchDoc: repeat(CELL_L), repeat(CELL_H), repeat(OUTPUT)

### Ports
A0, A1, CONV, EN, PART1_BUSY, PART1_CLK, PART1_CS, PART1_DO, PART1_REST

### Nets
5V_0: C175.2 U10.1(VDD1)
40V: C157.1 C158.1 C159.2 C160.1 C162.1 C164.1 C166.1 C168.1 C170.1 C172.1 R119.2 U2.14(VDD) U3.14(VDD) U4.14(VDD) U5.14(VDD) U6.14(VDD) U7.14(VDD) U8.14(VDD) U9.14(VDD)
+5V_1: C7.2 C9.1 C29.1 C146.1 C194.1 C195.1 C196.1 R179.2 U1.1(AVCC) U1.37(AVCC) U1.38(AVCC) U1.48(AVCC) U11.2(Vin)  [also labelled AVCC_1]
AGND_1: C7.1 C8.1 C9.2 C15.2 C16.2 C17.2 C18.2 C29.2 C31.2 C32.1 C146.2 C194.2 C195.2 C196.2 C199.2 C200.2 R12.1 R172.2 SW1.1 SW1.3 SW1.5 U1.2(AGND) U1.8(RANGE) U1.16(DB0) U1.17(DB1) U1.18(DB2) U1.19(DB3) U1.20(DB4) U1.21(DB5) U1.22(DB6) U1.26(AGND) U1.27(DB9) U1.28(DB10) U1.29(DB11) U1.30(DB12) U1.31(DB13) U1.32(DB14/HBEN) U1.33(DB15/BYTE_SEL) U1.35(AGND) U1.40(AGND) U1.41(AGND) U1.43(REFGND) U1.46(REFGND) U1.47(AGND) U1.50(V1GND) U1.52(V2GND) U1.54(V3GND) U1.56(V4GND) U1.58(V5GND) U1.60(V6GND) U1.62(V7GND) U1.64(V8GND) U11.4(GND)
DGND_1: C2.2 C141.1 C198.1 C199.1 C200.1 R172.1 R173.1 U10.9(GND2)
DVCC_1: C8.2 R1.1 R2.1 R3.1 R4.2 R5.2 R13.1 R179.1 U1.23(VDRIVE)
GND: C175.1 U10.8(GND1)
GND_FC: C13.2 C14.2 DB1.2 DB1.21 R120.1
GND_FC1: C141.2 C157.2 C158.2 C159.1 C160.2 C162.2 C164.2 C166.2 C168.2 C170.2 C172.2 C198.2 DB1.38 DB1.39 R120.2 R173.2 U2.3(VSS) U2.15(GND) U3.3(VSS) U3.15(GND) U4.3(VSS) U4.15(GND) U5.3(VSS) U5.15(GND) U6.3(VSS) U6.15(GND) U7.3(VSS) U7.15(GND) U8.3(VSS) U8.15(GND) U9.3(VSS) U9.15(GND)
V_FC: C13.1 C14.1 DB1.1 DB1.20 R119.1
VCC_1: C2.1 U10.16(VDD2)
A0: U2.1(A0) U3.1(A0) U4.1(A0) U5.1(A0) U6.1(A0) U7.1(A0) U8.1(A0) U9.1(A0) ; port A0
A1: U2.16(A1) U3.16(A1) U4.16(A1) U5.16(A1) U6.16(A1) U7.16(A1) U8.16(A1) U9.16(A1) ; port A1
BUSY: R123.1 U1.14(BUSY)
C0: R118.1 U9.13(S1B)
C1: A9.2 U9.4(S1A) U9.12(S2B)
C2: A9.4 U9.5(S2A) U9.11(S3B)
C3: A9.6 U9.6(S3A) U9.10(S4B)
C4: A9.8 U5.13(S1B) U9.7(S4A)
C5: A10.2 U5.4(S1A) U5.12(S2B)
C6: A10.4 U5.5(S2A) U5.11(S3B)
C7: A10.6 U5.6(S3A) U5.10(S4B)
C8: A10.8 U5.7(S4A) U6.13(S1B)
C9: A11.2 U6.4(S1A) U6.12(S2B)
C10: A11.4 U6.5(S2A) U6.11(S3B)
C11: A11.6 U6.6(S3A) U6.10(S4B)
C12: A11.8 U4.13(S1B) U6.7(S4A)
C13: A12.2 U4.4(S1A) U4.12(S2B)
C14: A12.4 U4.5(S2A) U4.11(S3B)
C15: A12.6 U4.6(S3A) U4.10(S4B)
C16: A12.8 U4.7(S4A) U7.13(S1B)
C17: A13.2 U7.4(S1A) U7.12(S2B)
C18: A13.4 U7.5(S2A) U7.11(S3B)
C19: A13.6 U7.6(S3A) U7.10(S4B)
C20: A13.8 U3.13(S1B) U7.7(S4A)
C21: A14.2 U3.4(S1A) U3.12(S2B)
C22: A14.4 U3.5(S2A) U3.11(S3B)
C23: A14.6 U3.6(S3A) U3.10(S4B)
C24: A14.8 U2.13(S1B) U3.7(S4A)
C25: A15.2 U2.4(S1A) U2.12(S2B)
C26: A15.4 U2.5(S2A) U2.11(S3B)
C27: A15.6 U2.6(S3A) U2.10(S4B)
C28: A15.8 U2.7(S4A) U8.13(S1B)
C29: A16.2 U8.4(S1A) U8.12(S2B)
C30: A16.4 U8.5(S2A) U8.11(S3B)
C31: A16.6 U8.6(S3A) U8.10(S4B)
C32: A16.8 U8.7(S4A)
CH: sheet repeat(DI,1,8)/repeat(CELL_H)
CH1: U8.8(DA)
CH2: U2.8(DA)
CH3: U3.8(DA)
CH4: U7.8(DA)
CH5: U4.8(DA)
CH6: U6.8(DA)
CH7: U5.8(DA)
CH8: U9.8(DA)
CL: sheet repeat(DI,1,8)/repeat(CELL_L)
CL1: U8.9(DB)
CL2: U2.9(DB)
CL3: U3.9(DB)
CL4: U7.9(DB)
CL5: U4.9(DB)
CL6: U6.9(DB)
CL7: U5.9(DB)
CL8: U9.9(DB)
CLK: R121.1 U1.12(~{RD}/SCLK)
CONVA: U1.9(CONVST_A) U1.10(CONVST_B) ; port CONV  [also labelled CONVB]
CS: R122.1 U1.13(~{CS})
DO: R10.1 R11.1 R124.1
DOUT1: R125.2 ; port PART1_REST
DOUTA: R10.2 U1.24(DB7/DoutA)
DOUTB: R11.2 U1.25(DB8/DoutB)
EN: U2.2(EN) U3.2(EN) U4.2(EN) U5.2(EN) U6.2(EN) U7.2(EN) U8.2(EN) U9.2(EN) ; port EN
INT1: R128.2 ; port PART1_BUSY
OS0: R3.2 SW1.6 U1.3(OS0)
OS1: R2.2 SW1.4 U1.4(OS1)
OS2: R1.2 SW1.2 U1.5(OS2)
OUT: sheet repeat(DI,1,8)/repeat(OUTPUT)
OUT1: U1.63(V8)
OUT2: U1.61(V7)
OUT3: U1.59(V6)
OUT4: U1.57(V5)
OUT5: U1.55(V4)
OUT6: U1.53(V3)
OUT7: U1.51(V2)
OUT8: U1.49(V1)
REFIN: C15.1 C31.1 C32.2 U1.42(REFIN/REFOUT) U11.6(Vout)
REFSEL: R12.2 R13.2 U1.34(REF_SELECT)
REST: R9.1 U1.11(RESET)
SPI1CS: R127.2 ; port PART1_CS
SPI1DO: R129.2 ; port PART1_DO
SPI1SCK: R126.2 ; port PART1_CLK
NetA9_1: A9.1 DB1.22
NetA9_3: A9.3 DB1.4
NetA9_5: A9.5 DB1.23
NetA9_7: A9.7 DB1.5
NetA10_1: A10.1 DB1.24
NetA10_3: A10.3 DB1.6
NetA10_5: A10.5 DB1.25
NetA10_7: A10.7 DB1.7
NetA11_1: A11.1 DB1.26
NetA11_3: A11.3 DB1.8
NetA11_5: A11.5 DB1.27
NetA11_7: A11.7 DB1.9
NetA12_1: A12.1 DB1.28
NetA12_3: A12.3 DB1.10
NetA12_5: A12.5 DB1.29
NetA12_7: A12.7 DB1.11
NetA13_1: A13.1 DB1.30
NetA13_3: A13.3 DB1.12
NetA13_5: A13.5 DB1.31
NetA13_7: A13.7 DB1.13
NetA14_1: A14.1 DB1.32
NetA14_3: A14.3 DB1.14
NetA14_5: A14.5 DB1.33
NetA14_7: A14.7 DB1.15
NetA15_1: A15.1 DB1.34
NetA15_3: A15.3 DB1.16
NetA15_5: A15.5 DB1.35
NetA15_7: A15.7 DB1.17
NetA16_1: A16.1 DB1.36
NetA16_3: A16.3 DB1.18
NetA16_5: A16.5 DB1.37
NetA16_7: A16.7 DB1.19
NetC16_1: C16.1 U1.44(REFCAPA) U1.45(REFCAPB)
NetC17_1: C17.1 U1.39(REGCAP)
NetC18_1: C18.1 U1.36(REGCAP)
NetDB1_3: DB1.3 R118.2
NetR4_1: R4.1 U1.7(~{STBY})
NetR5_1: R5.1 U1.6(~{PAR}/SER/BYTE_SEL)
NetR9_2: R9.2 U10.15(OUTA)
NetR121_2: R121.2 U10.14(OUTB)
NetR122_2: R122.2 U10.13(OUTC)
NetR123_2: R123.2 U10.12(IND)
NetR124_2: R124.2 U10.11(INE)
NetR125_1: R125.1 U10.2(INA)
NetR126_1: R126.1 U10.3(INB)
NetR127_1: R127.1 U10.4(INC)
NetR128_1: R128.1 U10.5(OUTD)
NetR129_1: R129.1 U10.6(OUTE)

Not connected (* = marked no-connect by the designer): U1 15(FRSTDATA); U10 7(NC) 10(NC); U11 1(DNC) 3(TEMP) 5(TRIM/NR) 7(NC) 8(DNC)

### Buses and harness runs
bus CH[1..8]
bus CL[1..8]
bus OUT[1..8]

### Notes on the sheet
- (near SW1) 过采样选择
- (near R10) 触发选择
- 数据口选择
- (near R13) 参考电压选择

### Library data of the parts
A9-A16 = RESPACK5
C2 C7 C8 C13 C14 C32 C141 C157-C160 C162 C164 C166 C168 C170 C172 C175 C198-C200 = Cap: Capacitor; Published: 8-Jun-2000; LatestRevisionDate: 17-Jul-2002; LatestRevisionNote: Re-released for DXP Platform.; PackageReference: RAD-0.3; Publisher: Altium Limited; PackageDescription: Radial Cap, Thru-Hole; 2 Leads; 0.3 in Pin Spacing
C9 C15-C18 C29 C31 C146 C194-C196 = Cap Pol1: Polarized Capacitor (Radial); Published: 8-Jun-2000; LatestRevisionDate: 17-Jul-2002; LatestRevisionNote: Re-released for DXP Platform.; PackageReference: RB7.6-15; Publisher: Altium Limited
R1-R5 R9-R13 R118-R129 R172 R173 R179 = Res2: Resistor; Published: 8-Jun-2000; LatestRevisionDate: 17-Jul-2002; LatestRevisionNote: Re-released for DXP Platform.; PackageReference: AXIAL-0.4; Publisher: Altium Limited; PackageDescription: Axial Device, Thru-Hole; 2 Leads; 0.4 in Pin Spacing
SW1 = Header 3X2: Header, 3-Pin, Dual row; LatestRevisionDate: 17-Jul-2002; LatestRevisionNote: Re-released for DXP Platform.; Publisher: Altium Limited

## Sheet AD628模块.SchDoc
size A4
Used 8 times, as channels U_电池电压检测/DI1, U_电池电压检测/DI2, U_电池电压检测/DI3, U_电池电压检测/DI4, U_电池电压检测/DI5, U_电池电压检测/DI6, U_电池电压检测/DI7, U_电池电压检测/DI8. Parts and nets are listed once, with the designators drawn on the sheet.
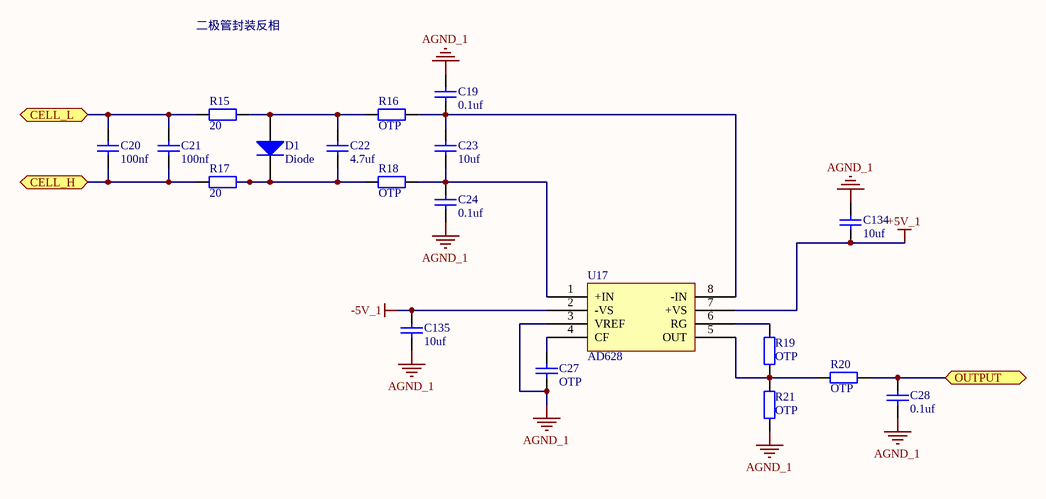
[diagram p6: AD628模块.SchDoc]

### Parts
C19  value 0.1uf  [0805C]  (hidden comment: Cap)
C20  value 100nf  [0805C]  (hidden comment: Cap)
C21  value 100nf  [0805C]  (hidden comment: Cap)
C22  value 4.7uf  [0805C]  (hidden comment: Cap)
C23  value 10uf  [0805C]  (hidden comment: Cap)
C24  value 0.1uf  [0805C]  (hidden comment: Cap)
C27  value OTP  [0805C]  (hidden comment: Cap)
C28  value 0.1uf  [0805C]  (hidden comment: Cap)
C134  value 10uf  [0805C]  (hidden comment: Cap)
C135  value 10uf  [0805C]  (hidden comment: Cap)
D1  Diode  [SMA]
R15  value 20  [0805R]  (hidden comment: Res2)
R16  value OTP  [0805R]  (hidden comment: Res2)
R17  value 20  [0805R]  (hidden comment: Res2)
R18  value OTP  [0805R]  (hidden comment: Res2)
R19  value OTP  [0805R]  (hidden comment: Res2)
R20  value OTP  [0805R]  (hidden comment: Res2)
R21  value OTP  [0805R]  (hidden comment: Res2)
U17  AD628  [MSOP8]

### Ports
CELL_H, CELL_L, OUTPUT

### Nets
+5V_1: C134.2 U17.7(+VS)
-5V_1: C135.2 U17.2(-VS)
AGND_1: C19.2 C24.1 C27.1 C28.1 C134.1 C135.1 R21.1 U17.3(VREF)
CELL_H: C20.1 C21.1 R17.2 ; port CELL_H
CELL_L: C20.2 C21.2 R15.2 ; port CELL_L
OUTPUT: C28.2 R20.1 ; port OUTPUT
NetC19_1: C19.1 C23.2 R16.1 U17.8(-IN)
NetC22_1: C22.1 D1.2(K) R17.1 R18.2
NetC22_2: C22.2 D1.1(A) R15.1 R16.2
NetC23_1: C23.1 C24.2 R18.1 U17.1(+IN)
NetC27_2: C27.2 U17.4(CF)
NetR19_1: R19.1 R20.2 R21.2 U17.5(OUT)
NetR19_2: R19.2 U17.6(RG)

### Channels
U_电池电压检测/DI1: designators end in _DI1; ports CELL_H=CH1 CELL_L=CL1 OUTPUT=OUT1
U_电池电压检测/DI2: designators end in _DI2; ports CELL_H=CH2 CELL_L=CL2 OUTPUT=OUT2
U_电池电压检测/DI3: designators end in _DI3; ports CELL_H=CH3 CELL_L=CL3 OUTPUT=OUT3
U_电池电压检测/DI4: designators end in _DI4; ports CELL_H=CH4 CELL_L=CL4 OUTPUT=OUT4
U_电池电压检测/DI5: designators end in _DI5; ports CELL_H=CH5 CELL_L=CL5 OUTPUT=OUT5
U_电池电压检测/DI6: designators end in _DI6; ports CELL_H=CH6 CELL_L=CL6 OUTPUT=OUT6
U_电池电压检测/DI7: designators end in _DI7; ports CELL_H=CH7 CELL_L=CL7 OUTPUT=OUT7
U_电池电压检测/DI8: designators end in _DI8; ports CELL_H=CH8 CELL_L=CL8 OUTPUT=OUT8

### Notes on the sheet
- 二极管封装反相

### Library data of the parts
C19-C24 C27 C28 C134 C135 = Cap: Capacitor; Published: 8-Jun-2000; LatestRevisionDate: 17-Jul-2002; LatestRevisionNote: Re-released for DXP Platform.; PackageReference: RAD-0.3; Publisher: Altium Limited; PackageDescription: Radial Cap, Thru-Hole; 2 Leads; 0.3 in Pin Spacing
D1 = Diode: Default Diode; Published: 8-Jun-2000; LatestRevisionDate: 17-Jul-2002; LatestRevisionNote: Re-released for DXP Platform.; PackageVersion: Sep-1996; PackageReference: SMC; Publisher: Altium Limited; PackageDescription: DO-214-AB/SMC; 2 C-Bend Leads; Body 7.9 x 5.9 mm, inc. leads (LxW); Code_JEDEC: DO-214-AB
R15-R21 = Res2: Resistor; Published: 8-Jun-2000; LatestRevisionDate: 17-Jul-2002; LatestRevisionNote: Re-released for DXP Platform.; PackageReference: AXIAL-0.4; Publisher: Altium Limited; PackageDescription: Axial Device, Thru-Hole; 2 Leads; 0.4 in Pin Spacing

## Sheet 电源.SchDoc
size A2
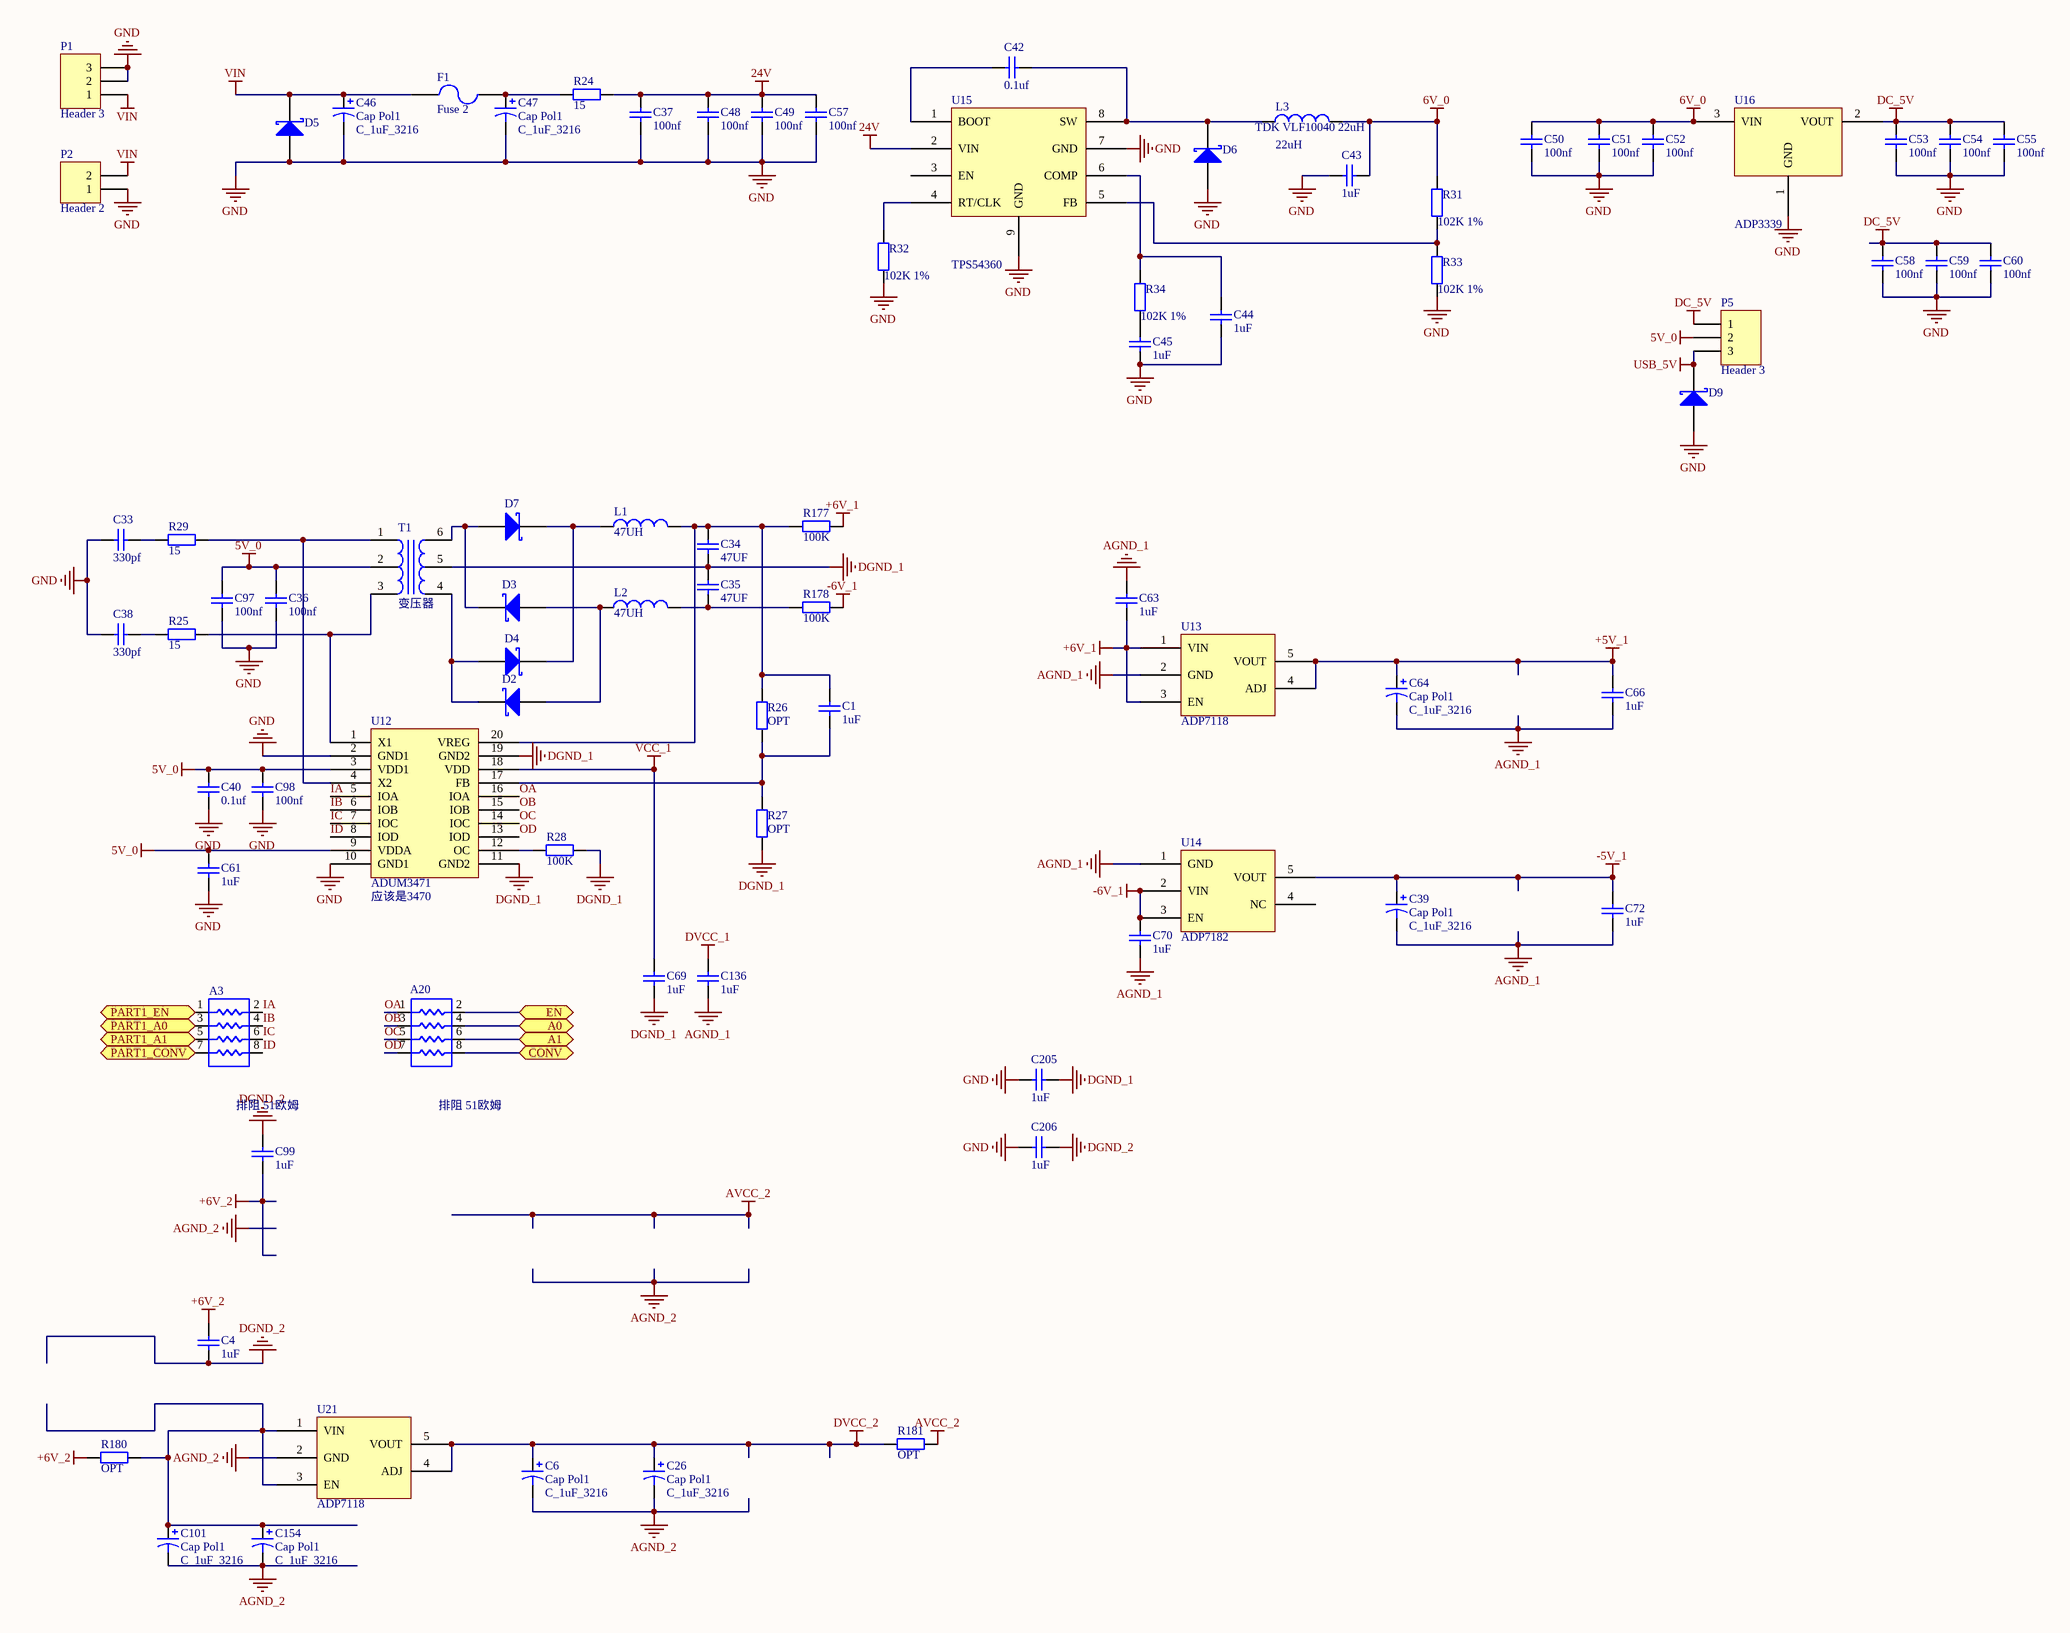
[diagram p7: 电源.SchDoc]

### Parts
A3  排阻 51欧姆  [RCA03-4D]
A20  排阻 51欧姆  [RCA03-4D]
C1  1uF  [0805C]
C4  1uF  [0805C]
C6  Cap Pol1  value C_1uF_3216  [3216]
C26  Cap Pol1  value C_1uF_3216  [3216]
C33  value 330pf  [0805C]  (hidden comment: Cap)
C34  value 47UF  [1812-C]  (hidden comment: Cap)
C35  value 47UF  [1812-C]  (hidden comment: Cap)
C36  value 100nf  [0805C]  (hidden comment: Cap)
C37  value 100nf  [1812-C]  (hidden comment: Cap)
C38  value 330pf  [0805C]  (hidden comment: Cap)
C39  Cap Pol1  value C_1uF_3216  [3216]
C40  value 0.1uf  [0805C]  (hidden comment: Cap)
C42  value 0.1uf  [独石电容]  (hidden comment: Cap)
C43  1uF  [SMD-EC-F8]
C44  1uF  [0805C]
C45  1uF  [0805C]
C46  Cap Pol1  value C_1uF_3216  [SMD-EC-F12.5]
C47  Cap Pol1  value C_1uF_3216  [0805C]
C48  value 100nf  [0805C]  (hidden comment: Cap)
C49  value 100nf  [0805C]  (hidden comment: Cap)
C50  value 100nf  [1812-C]  (hidden comment: Cap)
C51  value 100nf  [0805C]  (hidden comment: Cap)
C52  value 100nf  [0805C]  (hidden comment: Cap)
C53  value 100nf  [1812-C]  (hidden comment: Cap)
C54  value 100nf  [0805C]  (hidden comment: Cap)
C55  value 100nf  [0805C]  (hidden comment: Cap)
C57  value 100nf  [1812-C]  (hidden comment: Cap)
C58  value 100nf  [0805C]  (hidden comment: Cap)
C59  value 100nf  [0805C]  (hidden comment: Cap)
C60  value 100nf  [0805C]  (hidden comment: Cap)
C61  1uF  [0805C]
C63  1uF  [0805C]
C64  Cap Pol1  value C_1uF_3216  [3216]
C66  1uF  [0805C]
C69  1uF  [0805C]
C70  1uF  [0805C]
C72  1uF  [0805C]
C97  value 100nf  [0805C]  (hidden comment: Cap)
C98  value 100nf  [0805C]  (hidden comment: Cap)
C99  1uF  [0805C]
C101  Cap Pol1  value C_1uF_3216  [3216]
C136  1uF  [0805C]
C154  Cap Pol1  value C_1uF_3216  [3216]
C205  1uF  [7.5mm-C]
C206  1uF  [7.5mm-C]
D2  (no value)  [FB1206]
D3  (no value)  [FB1206]
D4  (no value)  [FB1206]
D5  (no value)  [SMB1]
D6  (no value)  [SMA]
D7  (no value)  [FB1206]
D9  (no value)  [SMA]
F1  Fuse 2  [1812-PPTC]
L1  value 47UH  [1812-R]  (hidden comment: Inductor)
L2  value 47UH  [1812-R]  (hidden comment: Inductor)
L3  TDK VLF10040 22uH  value 22uH  [RH74]
P1  Header 3  [DC-005A]
P2  Header 2  [2EDGK-2P]
P5  Header 3  [SIP03]
R24  value 15  [FB1206]  (hidden comment: Res2)
R25  value 15  [0805R]  (hidden comment: Res2)
R26  value OPT  [0805R]  (hidden comment: Res2)
R27  value OPT  [0805R]  (hidden comment: Res2)
R28  value 100K  [0805R]  (hidden comment: Res2)
R29  value 15  [0805R]  (hidden comment: Res2)
R31  102K 1%  [0805R]
R32  102K 1%  [0805R]
R33  102K 1%  [0805R]
R34  102K 1%  [0805R]
R177  value 100K  [0805R]  (hidden comment: Res2)
R178  value 100K  [0805R]  (hidden comment: Res2)
R180  value OPT  [0805R]  (hidden comment: Res2)
R181  value OPT  [0805R]  (hidden comment: Res2)
T1  变压器  [变压器]
U12  ADUM3471  [SSOP20]
U13  ADP7118  [SOT-23-5]
U14  ADP7182  [SOT-23-5]
U15  TPS54360  [TPS54360]
U16  ADP3339  [_SOT-223]
U21  ADP7118  [SOT-23-5]

### Ports
A0, A1, CONV, EN, PART1_A0, PART1_A1, PART1_CONV, PART1_EN

### Nets
5V_0: C36.2 C40.1 C61.1 C97.2 C98.2 P5.2 T1.2 U12.3(VDD1) U12.9(VDDA)
6V_0: C43.1 C50.2 C51.2 C52.2 L3.2 R31.2 U16.3(VIN)
24V: C37.2 C48.2 C49.2 C57.2 R24.2 U15.2(VIN)
+5V_1: C64.1 C66.1 U13.4(ADJ) U13.5(VOUT)
+6V_1: C63.2 R177.2 U13.1(VIN) U13.3(EN)
+6V_2: C4.1 C99.2 R180.1
-5V_1: C39.1 C72.1 U14.5(VOUT)
-6V_1: C70.1 R178.2 U14.2(VIN) U14.3(EN)
AGND_1: C39.2 C63.1 C64.2 C66.2 C70.2 C72.2 C136.2 U13.2(GND) U14.1(GND)
AGND_2: C6.2 C26.2 C101.2 C154.2 U21.2(GND)
AVCC_2: R181.2  [project net +5V_2]
DC_5V: C53.2 C54.2 C55.2 C58.2 C59.2 C60.2 P5.1 U16.2(VOUT)
DGND_1: C34.1 C35.2 C69.2 C205.2 R27.2 R28.2 T1.5 U12.11(GND2) U12.19(GND2)
DGND_2: C4.2 C99.1 C206.2
DVCC_1: C136.1
DVCC_2: C6.1 C26.1 R181.1 U21.4(ADJ) U21.5(VOUT)
GND: C33.1 C36.1 C37.1 C38.1 C40.2 C43.2 C44.2 C45.2 C46.2 C47.2 C48.1 C49.1 C50.1 C51.1 C52.1 C53.1 C54.1 C55.1 C57.1 C58.1 C59.1 C60.1 C61.2 C97.1 C98.1 C205.1 C206.1 D5.1(A) D6.1(A) D9.1(A) P1.2 P1.3 P2.1 R32.1 R33.1 U12.2(GND1) U12.10(GND1) U15.7(GND) U15.9(GND) U16.1(GND)
USB_5V: D9.2(K) P5.3
VCC_1: C69.1 U12.18(VDD)
VIN: C46.1 D5.2(K) F1.1 P1.1 P2.2
A0: A20.4 ; port A0
A1: A20.6 ; port A1
CONVA: A20.8 ; port CONV
DOUT2: A3.1 ; port PART1_EN
DOUT3: A3.3 ; port PART1_A0
DOUT4: A3.5 ; port PART1_A1
EN: A20.2 ; port EN
IA: A3.2 U12.5(IOA)
IB: A3.4 U12.6(IOB)
IC: A3.6 U12.7(IOC)
ID: A3.8 U12.8(IOD)
OA: A20.1 U12.16(IOA)
OB: A20.3 U12.15(IOB)
OC: A20.5 U12.14(IOC)
OD: A20.7 U12.13(IOD)
PWM1: A3.7 ; port PART1_CONV
NetC1_1: C1.1 C34.2 L1.2 R26.1 R177.1 U12.20(VREG)
NetC1_2: C1.2 R26.2 R27.1 U12.17(FB)
NetC33_2: C33.2 R29.1
NetC35_1: C35.1 L2.2 R178.1
NetC38_2: C38.2 R25.1
NetC42_1: C42.1 U15.1(BOOT)
NetC42_2: C42.2 D6.2(K) L3.1 U15.8(SW)
NetC44_1: C44.1 R34.2 U15.6(COMP)
NetC45_1: C45.1 R34.1
NetC47_1: C47.1 F1.2 R24.1
NetC101_1: C101.1 C154.1 R180.2 U21.1(VIN) U21.3(EN)
NetD2_1: D2.1(A) D3.1(A) L2.1
NetD2_2: D2.2(K) D4.1(A) T1.4
NetD3_2: D3.2(K) D7.1(A) T1.6
NetD4_2: D4.2(K) D7.2(K) L1.1
NetR25_2: R25.2 T1.3 U12.1(X1)
NetR28_1: R28.1 U12.12(OC)
NetR29_2: R29.2 T1.1 U12.4(X2)
NetR31_1: R31.1 R33.2 U15.5(FB)
NetR32_2: R32.2 U15.4(RT/CLK)

Not connected (* = marked no-connect by the designer): U14 4(NC); U15 3(EN)

### Notes on the sheet
- (near U12) 应该是3470

### Library data of the parts
A3 A20 = RESPACK5
C1 C4 C33-C38 C40 C42-C45 C48-C55 C57-C61 C63 C66 C69 C70 C72 C97-C99 C136 C205 C206 = Cap: Capacitor; Published: 8-Jun-2000; LatestRevisionDate: 17-Jul-2002; LatestRevisionNote: Re-released for DXP Platform.; PackageReference: RAD-0.3; Publisher: Altium Limited; PackageDescription: Radial Cap, Thru-Hole; 2 Leads; 0.3 in Pin Spacing
  C1 C4 C43-C45 C61 C63 C66 C69 C70 C72 C99 C136 C205 C206: Value: 1uF
C6 C26 C39 C46 C47 C64 C101 C154 = Cap Pol1: Polarized Capacitor (Radial); Published: 8-Jun-2000; LatestRevisionDate: 17-Jul-2002; LatestRevisionNote: Re-released for DXP Platform.; PackageReference: RB7.6-15; Publisher: Altium Limited
D2-D7 D9 = Diode 11DQ03: Schottky Rectifier; Published: 8-Jun-2000; LatestRevisionDate: 17-Jul-2002; LatestRevisionNote: Re-released for DXP Platform.; DatasheetVersion: Dec-1997; PackageReference: DO-204AL; Publisher: Altium Limited; PackageDescription: Diode, Axial; Body 5.2 x 2.7 mm (LxDia. max), Lead Dia. 0.86 mm (max); Code_JEDEC: DO-204-AL; ComponentLink1Description: Manufacturer Link; ComponentLink1URL: http://www.irf.com/; ComponentLink2Description: Datasheet; ComponentLink2URL: http://www.irf.com/product-info/datasheets/data/11dq03.pdf
F1 = Fuse 2: Fuse; Published: 8-Jun-2000; LatestRevisionDate: 17-Jul-2002; LatestRevisionNote: Re-released for DXP Platform.; PackageReference: PIN-W2/E2.8; Publisher: Altium Limited; PackageDescription: Thru-Hole; 2 Leads
L1-L3 = Inductor: Code_IEC: 1005; Published: 8-Jun-2000; LatestRevisionDate: 29-May-2009; LatestRevisionNote: IPC-7351 Footprint Added.; PackageReference: 0402-A; Publisher: Altium Limited; PackageDescription: Chip Inductor; Code_JEITA: 0402
P1 P5 = Header 3: Header, 3-Pin; LatestRevisionDate: 17-Jul-2002; LatestRevisionNote: Re-released for DXP Platform.; Publisher: Altium Limited
P2 = Header 2: Header, 2-Pin; LatestRevisionDate: 17-Jul-2002; LatestRevisionNote: Re-released for DXP Platform.; Publisher: Altium Limited
R24-R29 R31-R34 R177 R178 R180 R181 = Res2: Resistor; Published: 8-Jun-2000; LatestRevisionDate: 17-Jul-2002; LatestRevisionNote: Re-released for DXP Platform.; PackageReference: AXIAL-0.4; Publisher: Altium Limited; PackageDescription: Axial Device, Thru-Hole; 2 Leads; 0.4 in Pin Spacing
  R31-R34: Value: 102K

## Sheet 数字部分.SchDoc
size A2
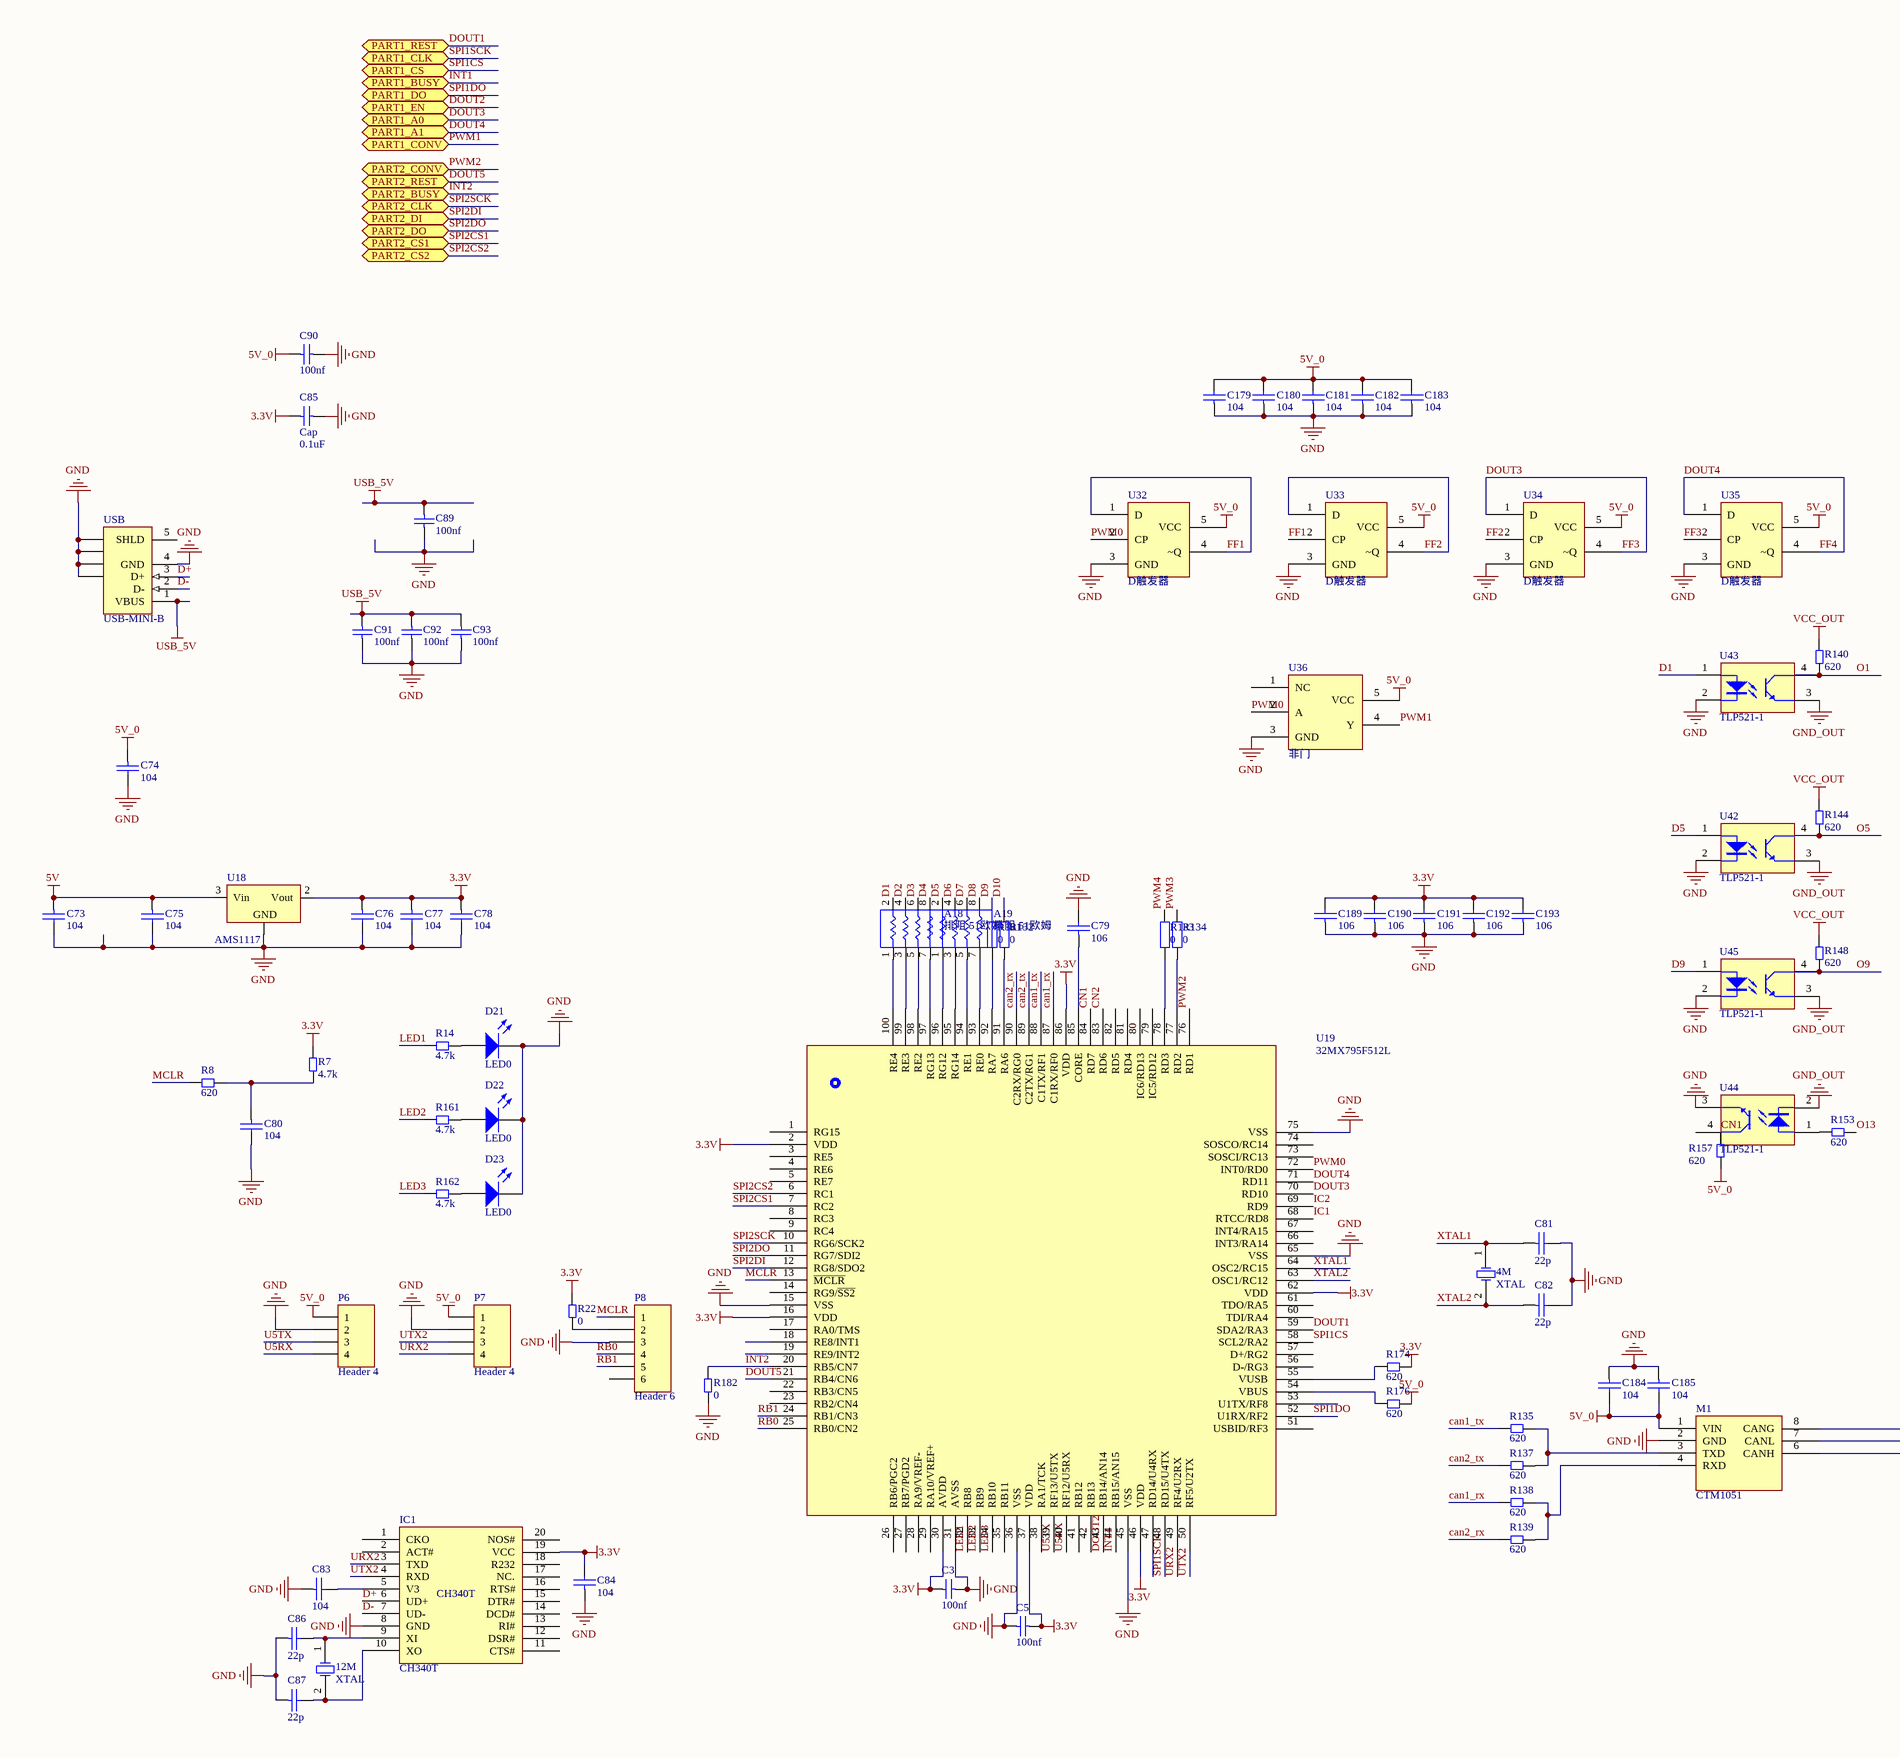
[diagram p8: 数字部分.SchDoc, left]
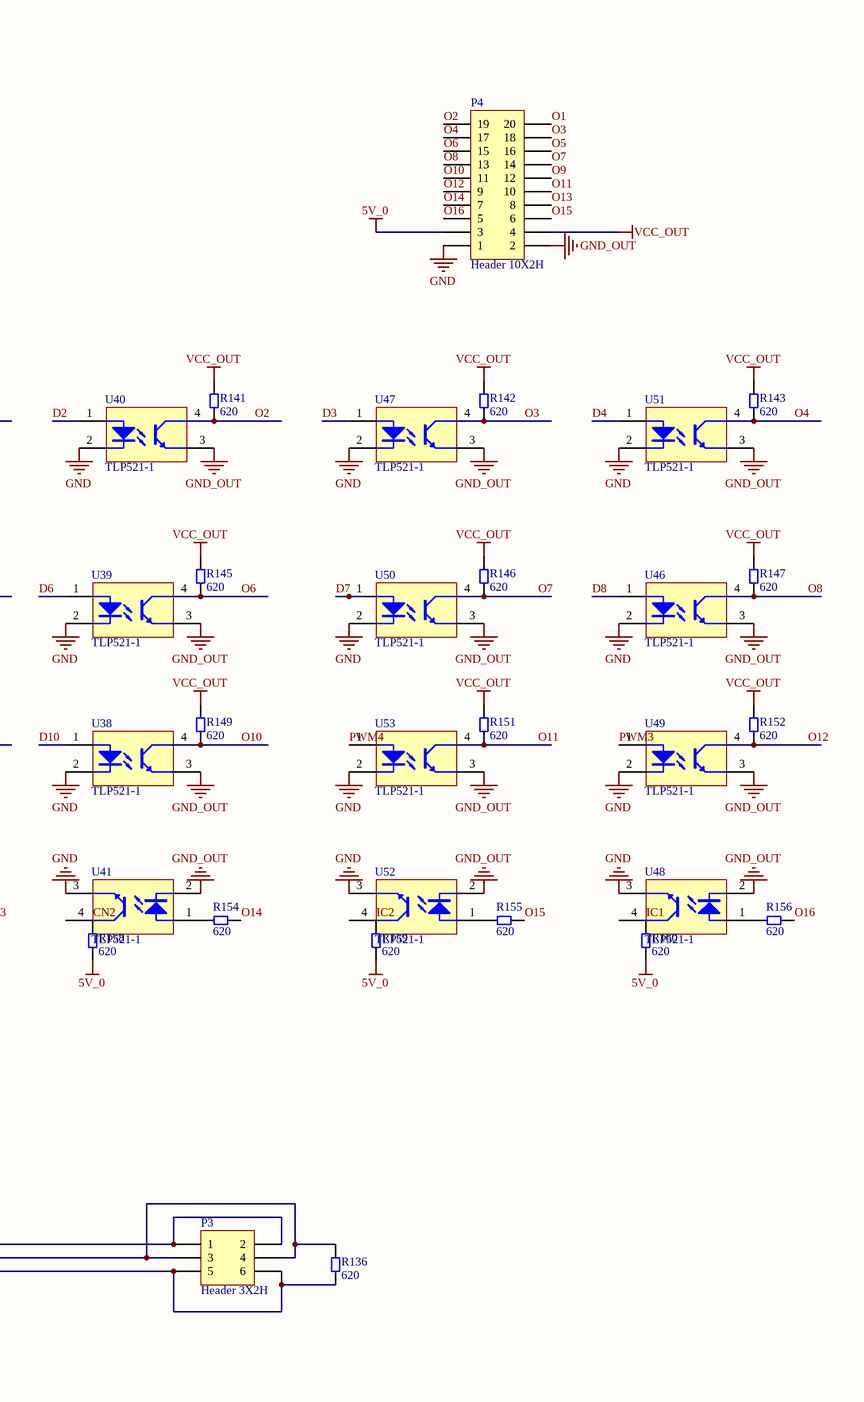
[diagram p9: 数字部分.SchDoc, right]

### Parts
4M  XTAL  [5032-xtal]
12M  XTAL  [5032-xtal]
A18  排阻 51欧姆  [RCA03-4D]
A19  排阻 51欧姆  [RCA03-4D]
C3  value 100nf  [0805C]  (hidden comment: Cap)
C5  value 100nf  [0805C]  (hidden comment: Cap)
C73  104  [0805C]
C74  104  [0805C]
C75  104  [0805C]
C76  104  [0805C]
C77  104  [0805C]
C78  104  [0805C]
C79  106  [0805C]
C80  104  [0805C]
C81  22p  [0805C]
C82  22p  [0805C]
C83  104  [0805C]
C84  104  [0805C]
C85  Cap  value 0.1uF  [0805C]
C86  22p  [0805C]
C87  22p  [0805C]
C89  value 100nf  [1812-C]  (hidden comment: Cap)
C90  value 100nf  [0805C]  (hidden comment: Cap)
C91  value 100nf  [0805C]  (hidden comment: Cap)
C92  value 100nf  [0805C]  (hidden comment: Cap)
C93  value 100nf  [0805C]  (hidden comment: Cap)
C179  104  [0805C]
C180  104  [0805C]
C181  104  [0805C]
C182  104  [0805C]
C183  104  [0805C]
C184  104  [0805C]
C185  104  [0805C]
C189  106  [0805C]
C190  106  [0805C]
C191  106  [0805C]
C192  106  [0805C]
C193  106  [0805C]
D21  LED0  [0805C]
D22  LED0  [0805C]
D23  LED0  [0805C]
IC1  CH340T  [TSSOP20]
M1  CTM1051  [CTM1051]
P3  Header 3X2H  [3.81MM-3P*2]
P4  Header 10X2H  [20P牛角]
P6  Header 4  [PH2.0 D-L-4P]
P7  Header 4  [PH2.0 D-L-4P]
P8  Header 6  [PH2.0 D-L-6P]
R7  4.7k  [0805R]
R8  620  [0805R]
R14  4.7k  [0805R]
R22  0  [0805R]
R131  value 0  [0603AR]  (hidden comment: Res2)
R132  value 0  [0603AR]  (hidden comment: Res2)
R133  value 0  [0603AR]  (hidden comment: Res2)
R134  value 0  [0603AR]  (hidden comment: Res2)
R135  620  [0805R]
R136  620  [FB1206]
R137  620  [0805R]
R138  620  [0805R]
R139  620  [0805R]
R140  620  [0805R]
R141  620  [0805R]
R142  620  [0805R]
R143  620  [0805R]
R144  620  [0805R]
R145  620  [0805R]
R146  620  [0805R]
R147  620  [0805R]
R148  620  [0805R]
R149  620  [0805R]
R151  620  [0805R]
R152  620  [0805R]
R153  620  [0805R]
R154  620  [0805R]
R155  620  [0805R]
R156  620  [0805R]
R157  620  [0805R]
R158  620  [0805R]
R159  620  [0805R]
R160  620  [0805R]
R161  4.7k  [0805R]
R162  4.7k  [0805R]
R174  620  [0805R]
R176  620  [0805R]
R182  0  [0805R]
U18  AMS1117  [_SOT-223]
U19  32MX795F512L  [TQFP100]
U32  D触发器  [SOT-23-5]
U33  D触发器  [SOT-23-5]
U34  D触发器  [SOT-23-5]
U35  D触发器  [SOT-23-5]
U36  非门  [SOT-23-5]
U38  TLP521-1  [SOP4]
U39  TLP521-1  [SOP4]
U40  TLP521-1  [SOP4]
U41  TLP521-1  [SOP4]
U42  TLP521-1  [SOP4]
U43  TLP521-1  [SOP4]
U44  TLP521-1  [SOP4]
U45  TLP521-1  [SOP4]
U46  TLP521-1  [SOP4]
U47  TLP521-1  [SOP4]
U48  TLP521-1  [SOP4]
U49  TLP521-1  [SOP4]
U50  TLP521-1  [SOP4]
U51  TLP521-1  [SOP4]
U52  TLP521-1  [SOP4]
U53  TLP521-1  [SOP4]
USB  USB-MINI-B  [USB-MINI-B - 引脚加长]

### Ports
PART1_A0, PART1_A1, PART1_BUSY, PART1_CLK, PART1_CONV, PART1_CS, PART1_DO, PART1_EN, PART1_REST, PART2_BUSY, PART2_CLK, PART2_CONV, PART2_CS1, PART2_CS2, PART2_DI, PART2_DO, PART2_REST

### Nets
3.3V: C3.2 C5.2 C76.1 C77.1 C78.1 C84.2 C85.2 C189.2 C190.2 C191.2 C192.2 C193.2 IC1.19(VCC) R7.1 R22.2 R174.2 U18.2(Vout) U19.2(VDD) U19.16(VDD) U19.30(AVDD) U19.37(VDD) U19.46(VDD) U19.62(VDD) U19.86(VDD)
5V: C73.1 C75.1 U18.3(Vin)
5V_0: C74.1 C90.2 C179.2 C180.2 C181.2 C182.2 C183.2 C184.2 C185.2 M1.1(VIN) P4.3 P6.1 P7.1 R157.2 R158.2 R159.2 R160.2 R176.2 U32.5(VCC) U33.5(VCC) U34.5(VCC) U35.5(VCC) U36.5(VCC)
GND: C3.1 C5.1 C73.2 C74.2 C75.2 C76.2 C77.2 C78.2 C79.2 C80.2 C81.2 C82.2 C83.1 C84.1 C85.1 C86.1 C87.1 C89.1 C90.1 C91.1 C92.1 C93.1 C179.1 C180.1 C181.1 C182.1 C183.1 C184.1 C185.1 C189.1 C190.1 C191.1 C192.1 C193.1 D21.2(K) D22.2(K) D23.2(K) IC1.8(GND) M1.2(GND) P4.1 P6.2 P7.2 P8.3 R182.1 U18.1(GND) U19.15(VSS) U19.31(AVSS) U19.36(VSS) U19.45(VSS) U19.65(VSS) U19.75(VSS) U32.3(GND) U33.3(GND) U34.3(GND) U35.3(GND) U36.3(GND) U38.2 U39.2 U40.2 U41.3 U42.2 U43.2 U44.3 U45.2 U46.2 U47.2 U48.3 U49.2 U50.2 U51.2 U52.3 U53.2 USB.4(GND) USB.6(SHLD) USB.7(SHLD) USB.8(SHLD) USB.9(SHLD)
GND_OUT: P4.2 U38.3 U39.3 U40.3 U41.2 U42.3 U43.3 U44.2 U45.3 U46.3 U47.3 U48.2 U49.3 U50.3 U51.3 U52.2 U53.3
USB_5V: C89.2 C91.2 C92.2 C93.2 USB.1(VBUS)
VCC_OUT: P4.4 R140.2 R141.2 R142.2 R143.2 R144.2 R145.2 R146.2 R147.2 R148.2 R149.2 R151.2 R152.2
can1_rx: R138.1 U19.87(C1RX/RF0)
can1_tx: R135.1 U19.88(C1TX/RF1)
can2_rx: R139.1 U19.90(C2RX/RG0)
can2_tx: R137.1 U19.89(C2TX/RG1)
CN1: R157.1 U19.84(RD7) U44.4
CN2: R158.1 U19.83(RD6) U41.4
D1: A18.2 U43.1
D2: A18.4 U40.1
D3: A18.6 U47.1
D4: A18.8 U51.1
D5: A19.2 U42.1
D6: A19.4 U39.1
D7: A19.6 U50.1
D8: A19.8 U46.1
D9: R131.1 U45.1
D10: R132.1 U38.1
D+: IC1.6(UD+) USB.3(D+)
D-: IC1.7(UD-) USB.2(D-)
DOUT1: U19.59(SDA2/RA3) ; port PART1_REST
DOUT2: U19.43(RB14/AN14) ; port PART1_EN
DOUT3: U19.70(RD10) U34.1(D) U34.4(~Q) U35.2(CP) ; port PART1_A0  [also labelled FF3]
DOUT4: U19.71(RD11) U35.1(D) U35.4(~Q) ; port PART1_A1  [also labelled FF4]
DOUT5: U19.21(RB4/CN6) ; port PART2_REST
FF1: U32.1(D) U32.4(~Q) U33.2(CP)
FF2: U33.1(D) U33.4(~Q) U34.2(CP)
IC1: R160.1 U19.68(RTCC/RD8) U48.4
IC2: R159.1 U19.69(RD9) U52.4
INT1: U19.44(RB15/AN15) ; port PART1_BUSY
INT2: R182.2 U19.20(RB5/CN7) ; port PART2_BUSY
LED1: R14.1 U19.32(RB8)
LED2: R161.1 U19.33(RB9)
LED3: R162.1 U19.34(RB10)
MCLR: P8.1 R8.1 U19.13(~{MCLR})
O1: P4.20 R140.1 U43.4
O2: P4.19 R141.1 U40.4
O3: P4.18 R142.1 U47.4
O4: P4.17 R143.1 U51.4
O5: P4.16 R144.1 U42.4
O6: P4.15 R145.1 U39.4
O7: P4.14 R146.1 U50.4
O8: P4.13 R147.1 U46.4
O9: P4.12 R148.1 U45.4
O10: P4.11 R149.1 U38.4
O11: P4.10 R151.1 U53.4
O12: P4.9 R152.1 U49.4
O13: P4.8 R153.2
O14: P4.7 R154.2
O15: P4.6 R155.2
O16: P4.5 R156.2
PWM0: U19.72(INT0/RD0) U32.2(CP) U36.2(A)
PWM1: U36.4(Y) ; port PART1_CONV
PWM2: U19.76(RD1) ; port PART2_CONV
PWM3: R134.1 U49.1
PWM4: R133.1 U53.1
RB0: P8.4 U19.25(RB0/CN2)
RB1: P8.5 U19.24(RB1/CN3)
SPI1CS: U19.58(SCL2/RA2) ; port PART1_CS
SPI1DO: U19.52(U1RX/RF2) ; port PART1_DO
SPI1SCK: U19.48(RD15/U4TX) ; port PART1_CLK
SPI2CS1: U19.7(RC2) ; port PART2_CS1
SPI2CS2: U19.6(RC1) ; port PART2_CS2
SPI2DI: U19.12(RG8/SDO2) ; port PART2_DI
SPI2DO: U19.11(RG7/SDI2) ; port PART2_DO
SPI2SCK: U19.10(RG6/SCK2) ; port PART2_CLK
U5RX: P6.4 U19.40(RF12/U5RX)
U5TX: P6.3 U19.39(RF13/U5TX)
URX2: IC1.3(TXD) P7.4 U19.49(RF4/U2RX)
UTX2: IC1.4(RXD) P7.3 U19.50(RF5/U2TX)
XTAL1: 4M.1(OSC1) C81.1 U19.64(OSC2/RC15)
XTAL2: 4M.2(OSC2) C82.1 U19.63(OSC1/RC12)
Net12M_1: 12M.1(OSC1) C86.2 IC1.9(XI)
Net12M_2: 12M.2(OSC2) C87.2 IC1.10(XO)
NetA18_1: A18.1 U19.100(RE4)
NetA18_3: A18.3 U19.99(RE3)
NetA18_5: A18.5 U19.98(RE2)
NetA18_7: A18.7 U19.97(RG13)
NetA19_1: A19.1 U19.96(RG12)
NetA19_3: A19.3 U19.95(RG14)
NetA19_5: A19.5 U19.94(RE1)
NetA19_7: A19.7 U19.93(RE0)
NetC79_1: C79.1 U19.85(CORE)
NetC80_1: C80.1 R7.2 R8.2
NetC83_2: C83.2 IC1.5(V3)
NetD21_1: D21.1(A) R14.2
NetD22_1: D22.1(A) R161.2
NetD23_1: D23.1(A) R162.2
NetM1_3: M1.3(TXD) R135.2 R137.2
NetM1_4: M1.4(RXD) R138.2 R139.2
NetM1_6: M1.6(CANH) P3.5 P3.6 R136.1
NetM1_7: M1.7(CANL) P3.3 P3.4 R136.2
NetM1_8: M1.8(CANG) P3.1 P3.2
NetP8_2: P8.2 R22.1
NetR131_2: R131.2 U19.92(RA7)
NetR132_2: R132.2 U19.91(RA6)
NetR133_2: R133.2 U19.78(RD3)
NetR134_2: R134.2 U19.77(RD2)
NetR153_1: R153.1 U44.1
NetR154_1: R154.1 U41.1
NetR155_1: R155.1 U52.1
NetR156_1: R156.1 U48.1
NetR174_1: R174.1 U19.55(VUSB)
NetR176_1: R176.1 U19.54(VBUS)

Not connected (* = marked no-connect by the designer): IC1 1(CKO) 2(ACT#) 11(CTS#) 12(DSR#) 13(RI#) 14(DCD#) 15(DTR#) 16(RTS#) 17(NC.) 18(R232) 20(NOS#); P8 6; U19 1(RG15) 3(RE5) 4(RE6) 5(RE7) 8(RC3) 9(RC4) 14(RG9/~{SS2}) 17(RA0/TMS) 18(RE8/INT1) 19(RE9/INT2) 22(RB3/CN5) 23(RB2/CN4) 26(RB6/PGC2) 27(RB7/PGD2) 28(RA9/VREF-) 29(RA10/VREF+) 35(RB11) 38(RA1/TCK) 41(RB12) 42(RB13) 47(RD14/U4RX) 51(USBID/RF3) 53(U1TX/RF8) 56(D-/RG3) 57(D+/RG2) 60(TDI/RA4) 61(TDO/RA5) 66(INT3/RA14) 67(INT4/RA15) 73(SOSCI/RC13) 74(SOSCO/RC14) 79(IC5/RD12) 80(IC6/RD13) 81(RD4) 82(RD5); U36 1(NC); USB 5(SHLD)

### Library data of the parts
4M 12M = XTAL: Crystal Oscillator; Published: 8-Jun-2000; LatestRevisionDate: 17-Jul-2002; LatestRevisionNote: Re-released for DXP Platform.; PackageReference: R38; Publisher: Altium Limited
A18 A19 = RESPACK5
C3 C5 C89-C93 = Cap: Capacitor; Published: 8-Jun-2000; LatestRevisionDate: 17-Jul-2002; LatestRevisionNote: Re-released for DXP Platform.; PackageReference: RAD-0.3; Publisher: Altium Limited; PackageDescription: Radial Cap, Thru-Hole; 2 Leads; 0.3 in Pin Spacing
C73-C84 C86 C87 C179-C185 C189-C193 = CAP: Capacitor
C85 = Cap Semi: Capacitor (Semiconductor SIM Model); Published: 8-Jun-2000; LatestRevisionDate: 29-May-2009; LatestRevisionNote: IPC-7351 Footprint Added.; PackageReference: C1206; Publisher: Altium Limited; PackageDescription: Chip Capacitor
D21-D23 = LED0: Typical INFRARED GaAs LED; Published: 8-Jun-2000; LatestRevisionDate: 08-Jul-2005; LatestRevisionNote: Mech Layer 1 removed.; PackageReference: LED-0; Publisher: Altium Limited; PackageDescription: LED; 2 Leads
P3 = Header 3X2H: Header, 3-Pin, Dual row, Right Angle; LatestRevisionDate: 17-Jul-2002; LatestRevisionNote: Re-released for DXP Platform.; Publisher: Altium Limited
P4 = Header 10X2H: Header, 10-Pin, Dual row, Right Angle; LatestRevisionDate: 17-Jul-2002; LatestRevisionNote: Re-released for DXP Platform.; Publisher: Altium Limited
P6 P7 = Header 4: Header, 4-Pin; LatestRevisionDate: 17-Jul-2002; LatestRevisionNote: Re-released for DXP Platform.; Publisher: Altium Limited
P8 = Header 6: Header, 6-Pin; LatestRevisionDate: 17-Jul-2002; LatestRevisionNote: Re-released for DXP Platform.; Publisher: Altium Limited
R7 R8 R14 R22 R135-R149 R151-R162 R174 R176 R182 = RES2
R131-R134 = Res2: Resistor; Published: 8-Jun-2000; LatestRevisionDate: 17-Jul-2002; LatestRevisionNote: Re-released for DXP Platform.; PackageReference: AXIAL-0.4; Publisher: Altium Limited; PackageDescription: Axial Device, Thru-Hole; 2 Leads; 0.4 in Pin Spacing
U18 = AMS1117: LDO
U38-U53 = TLP521-1: 光耦
USB = USB-MINI-B: USB 2.0, Right Angle, SMT, A Type, Receptacle, 5 Position, Black; ContactMaterial: Phosphor Bronze; ContactPlating: Gold (30) over Nickel; PCB_Layout: Complies with manufacturer's recommendation.; DrillSize: Corresponds to nominal value.; PanelGround: Without; Published: 15-Jul-2004; DatasheetDocument: 15-Nov-2002; PackageDocument: 15-Nov-2002; PackageReference: 440478; Publisher: Altium Limited; HousingMaterial: Thermoplastic; ComponentLink1Description: Manufacturer Link; ComponentLink1URL: http://www.tycoelectronics.com/; ComponentLink2Description: Packaging Specification; ComponentLink2URL: http://ecommas.tycoelectronics.com/commerce/DocumentDelivery/DDEController?Action=showdoc&DocId=Customer+Drawing%7F440478%7FB%7Fpdf%7FEnglish%7FC_440478_B.pdf